# Altium project SCH-45852_C.PrjPcb (part 1 of 3)
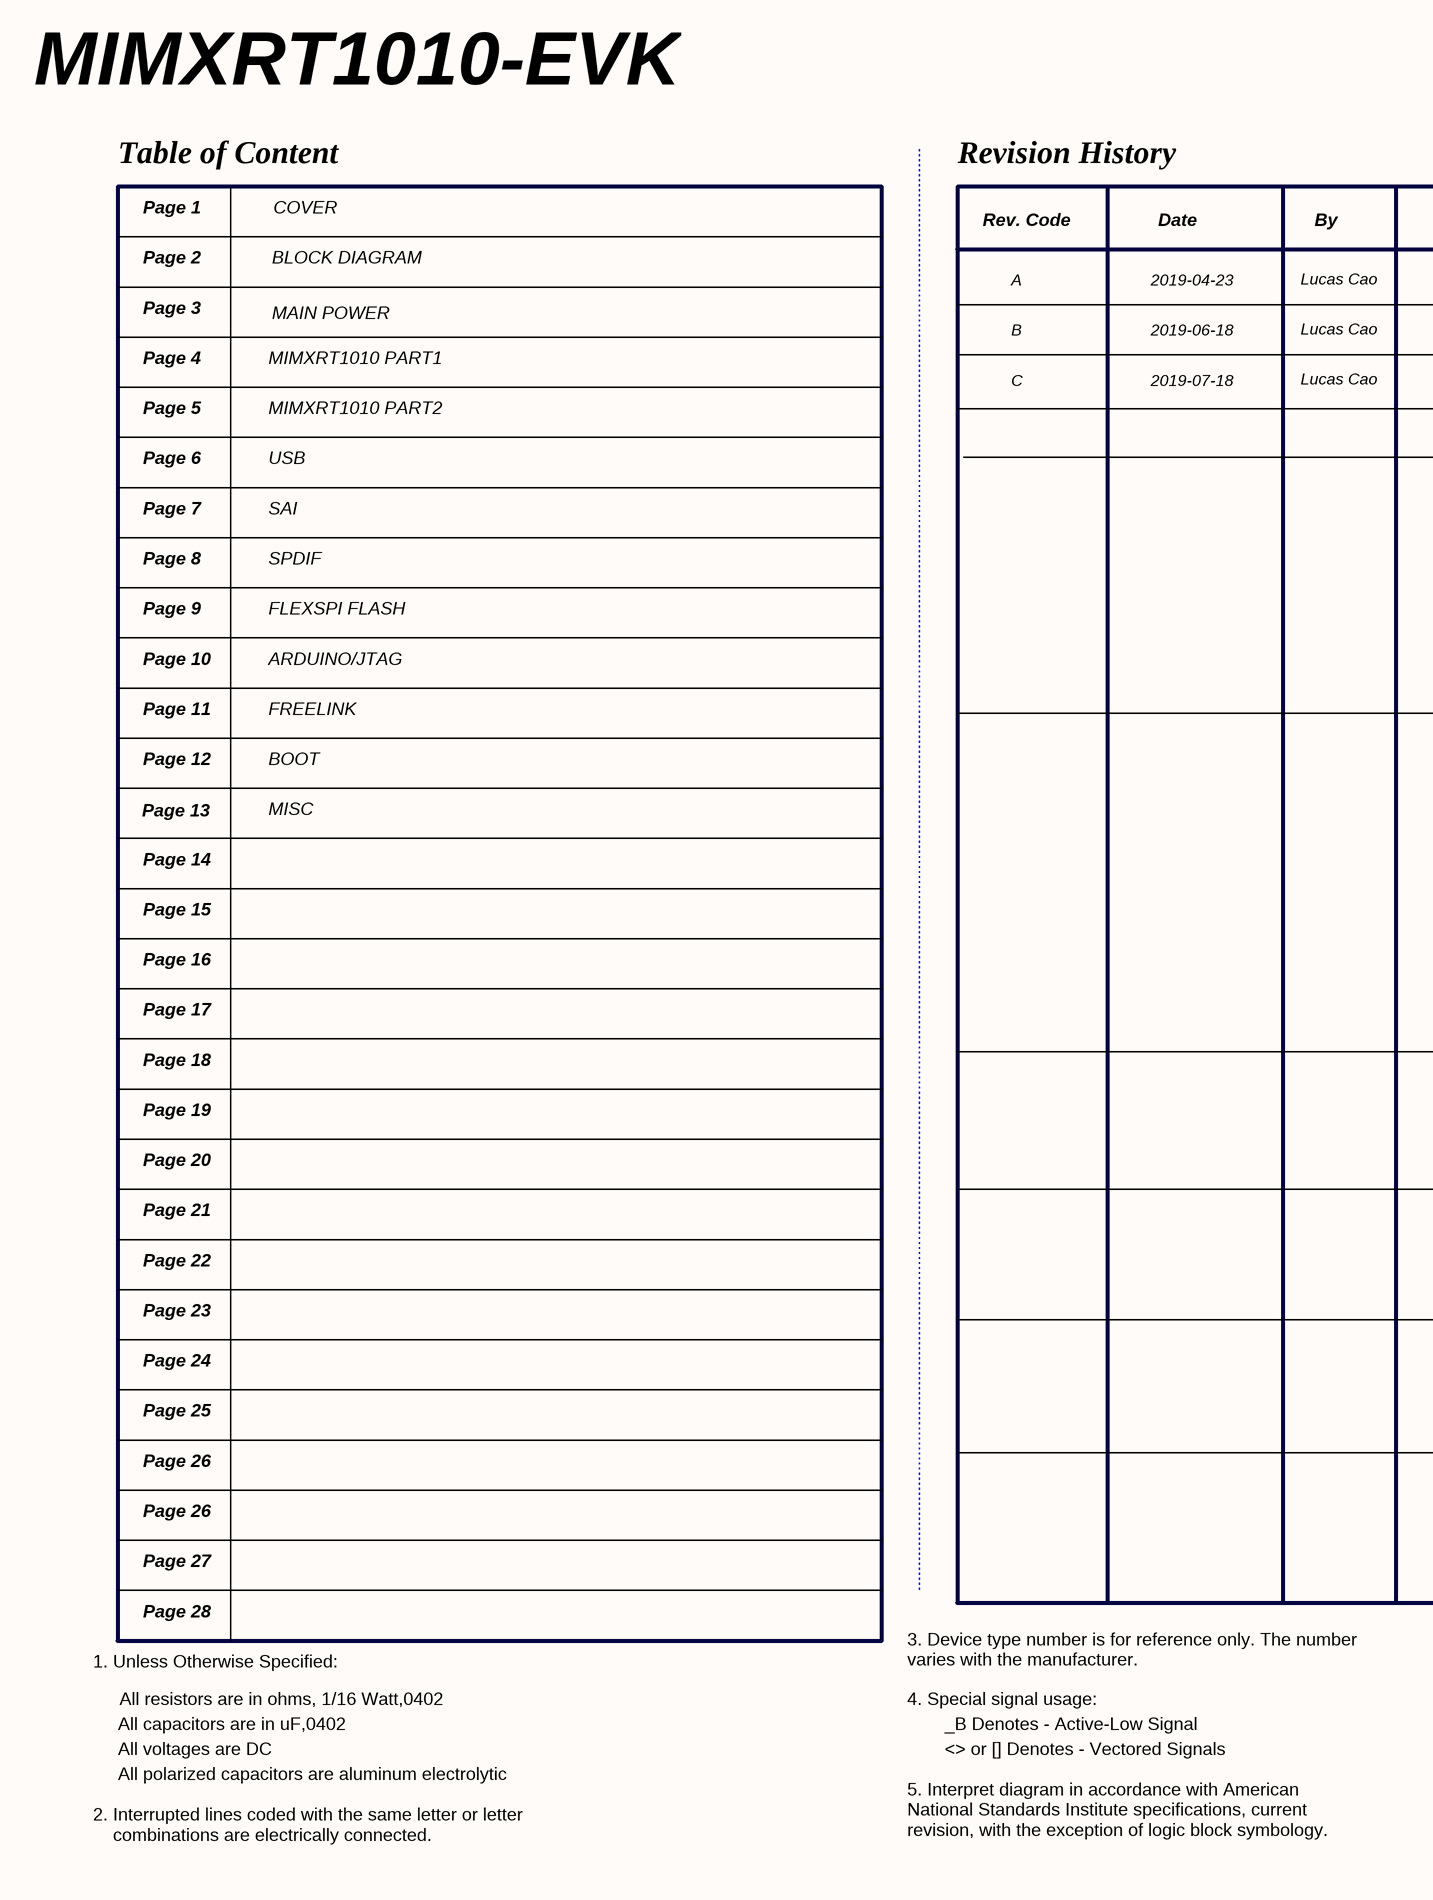
[diagram p0: 01 COVER.SchDoc, left]
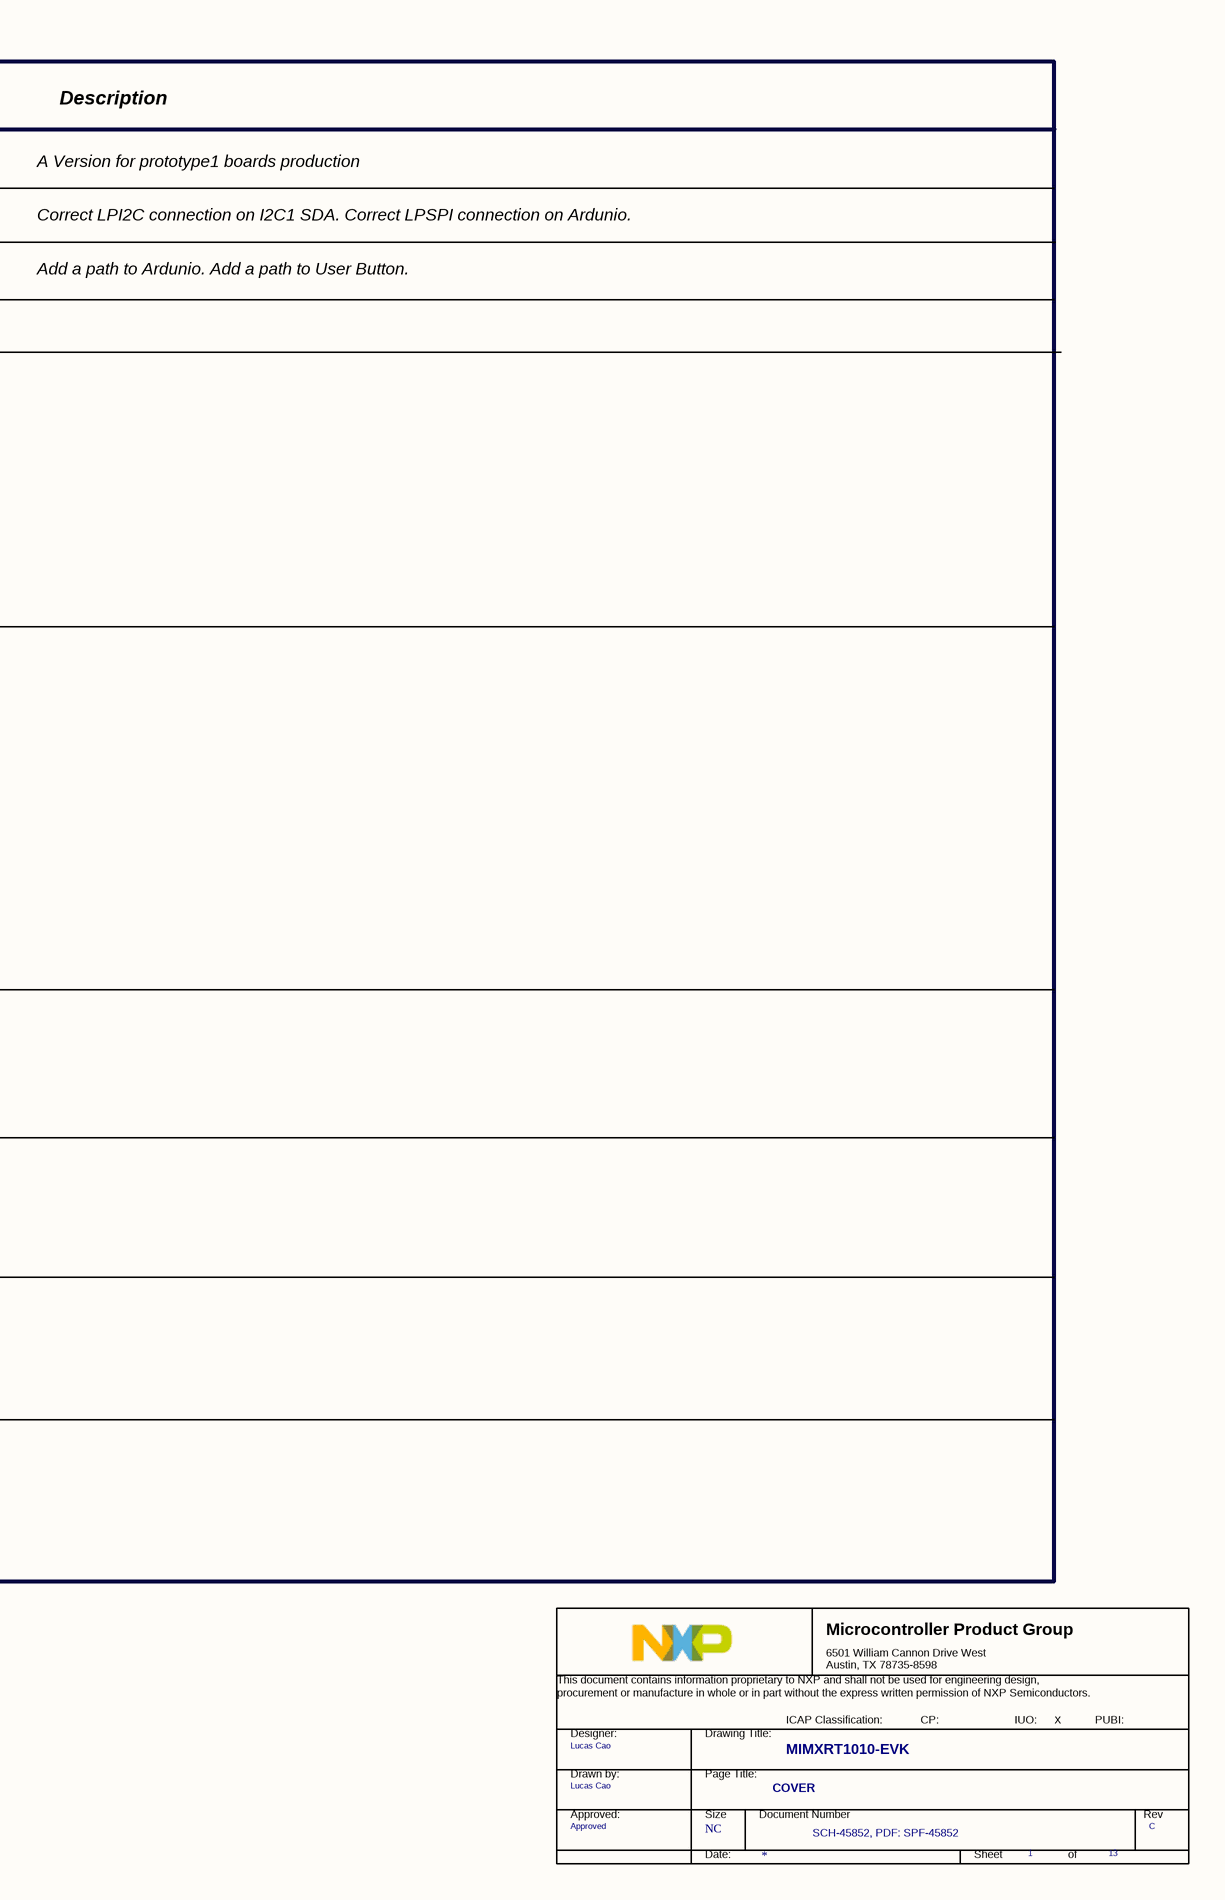
[diagram p1: 01 COVER.SchDoc, right]
13 sheets, 514 parts. Net scope: global (net labels, ports and power ports of the same name join across sheets).
Sheets:
  01 COVER.SchDoc
  02 BLOCK DIAGRAM.SchDoc
  03 MAIN POWER.SchDoc
  04 MIMXRT1010 PART1.SchDoc
  05 MIMXRT1010 PART2.SchDoc
  06 USB.SchDoc
  07 SAI.SchDoc
  08 SPDIF.SchDoc
  09 FLEXSPI FLASH.SchDoc
  10 ARDUINO_JTAG.SchDoc
  11 FREELINK.SchDoc
  12 BOOT.SchDoc
  13 MISC.SchDoc

## Sheet 01 COVER.SchDoc
size 513 x 386 mm

### Parts
(Parts that share a designator on the sheet are numbered #1, #2 ... from top to bottom, then left to right.)
*#1  Doc: SCH-45852, PDF: SPF-45852  RevCode: C  Title: MIMXRT1010-EVK  Page Size: NC  Page Number: 1  Page Count: 13  PageTitle: COVER  Designer: Lucas Cao  Approver: Approved  (hidden comment: TitleBlock_MCPG)  (graphical)

### Notes on the sheet
- MIMXRT1010-EVK
- Table of Content
- Revision History
- Page 1
- Page 2
- BLOCK DIAGRAM
- COVER
- Rev. Code
- Date
- By
- Description
- Page 3
- MAIN POWER
- A
- B
- 2019-04-23
- 2019-06-18
- Lucas Cao
- A Version for prototype1 boards production
- Correct LPI2C connection on I2C1 SDA. Correct LPSPI connection on Ardunio.
- Page 4
- MIMXRT1010 PART1
- C
- 2019-07-18
- Add a path to Ardunio. Add a path to User Button.
- Page 5
- MIMXRT1010 PART2
- Page 6
- Page 7
- USB
- SAI
- Page 8
- SPDIF
- Page 9
- FLEXSPI FLASH
- Page 10
- ARDUINO/JTAG
- Page 11
- Page 12
- FREELINK
- BOOT
- Page 13
- MISC
- Page 14
- Page 15
- Page 16
- Page 17
- Page 18
- Page 19
- Page 20
- Page 21
- Page 22
- Page 23
- Page 24
- Page 25
- Page 26
- Page 27
- Page 28
- 3. Device type number is for reference only. The number
  varies with the manufacturer.
- 1. Unless Otherwise Specified:
- All resistors are in ohms, 1/16 Watt,0402
- 4. Special signal usage:
- All capacitors are in uF,0402
- All voltages are DC
- 5. Interpret diagram in accordance with American
  National Standards Institute specifications, current
  revision, with the exception of logic block symbology.
- _B Denotes - Active-Low Signal
- <> or [] Denotes - Vectored Signals
- X
- 2. Interrupted lines coded with the same letter or letter
  combinations are electrically connected.
- All polarized capacitors are aluminum electrolytic
- (in symbol TitleBlock_MCPG) Microcontroller Product Group; 6501 William Cannon Drive West / Austin, TX 78735-8598; This document contains information proprietary to NXP and shall not be used for engineering design,; procurement or manufacture in whole or in part without the express written permission of NXP Semiconductors.; ICAP Classification:; CP:; IUO:; PUBI:; Designer:; Drawing Title:; Drawn by:; Page Title:; Approved:; Size; Document Number; Rev; Date:; Sheet; of

### Library data of the parts
*#1 = TitleBlock_MCPG: PUBI: ___; FIUO: X; OrgName: NXP Semiconductors; OrgAddr1: 6501 William Cannon Drive West; OrgAddr2: Austin, TX 78735-8598; Page Create Date: March  8, 1995; DrawnBy: Lucas Cao; Page Modify Date: *

## Sheet 02 BLOCK DIAGRAM.SchDoc
size 513 x 386 mm
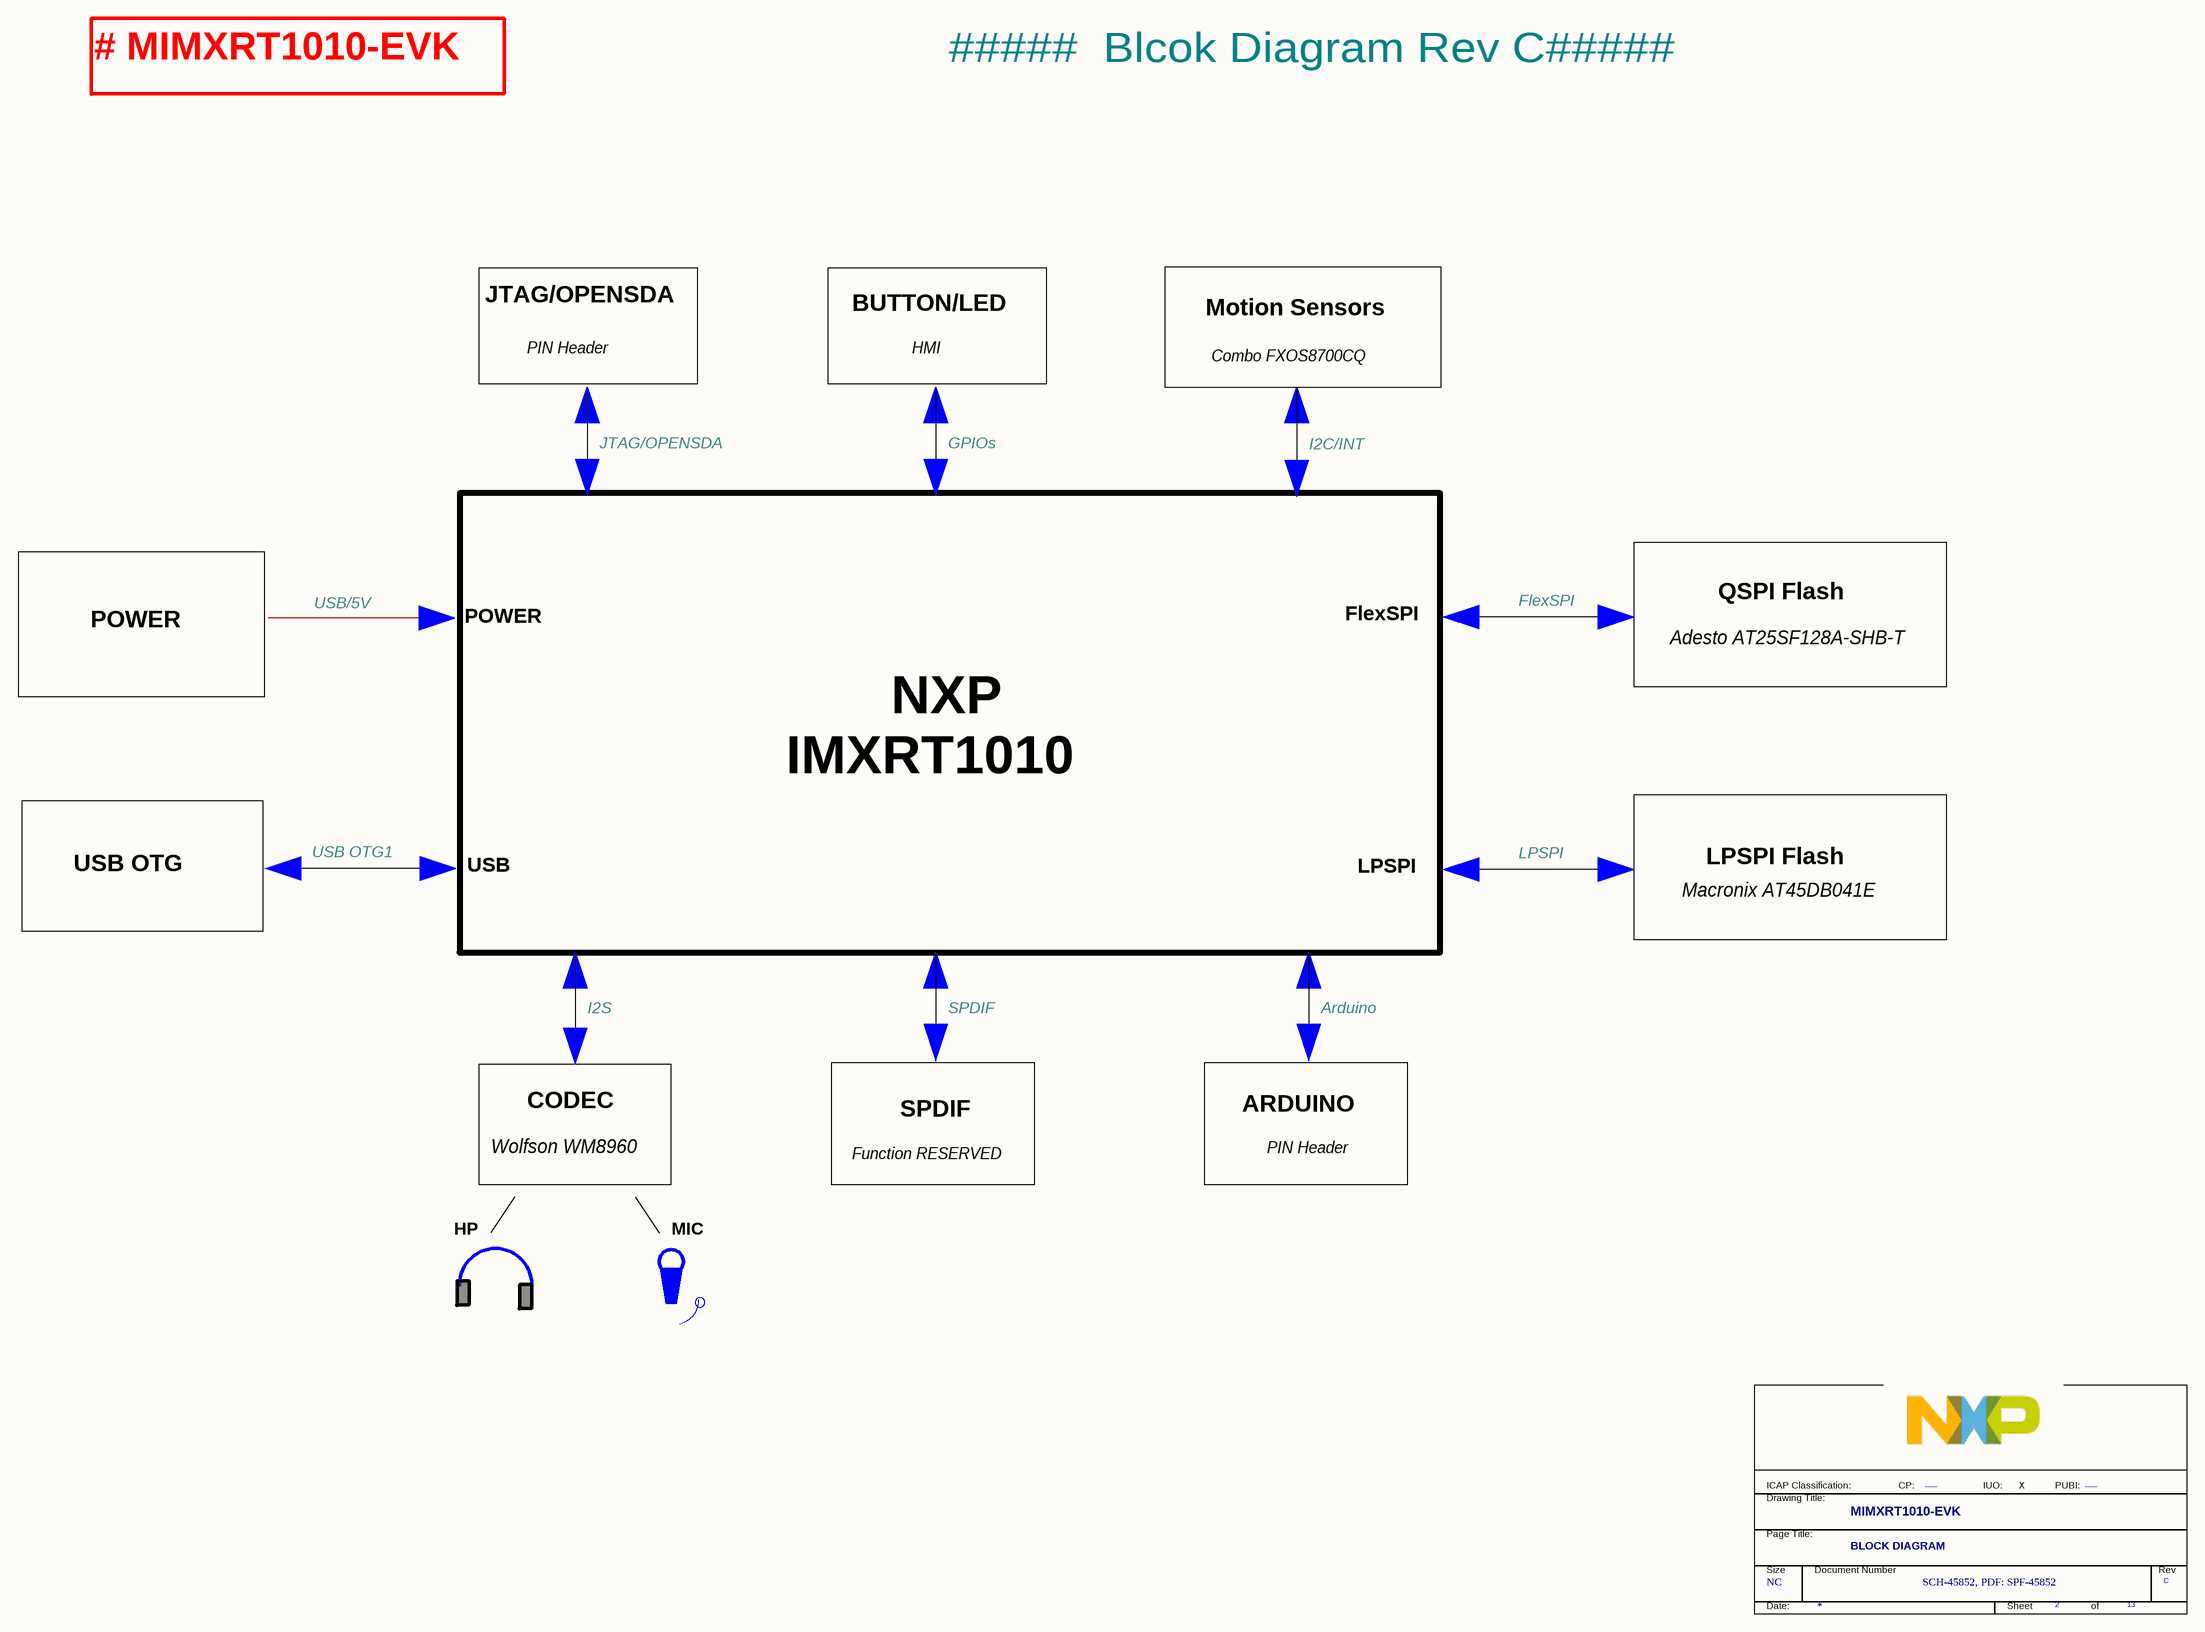
[diagram p2: 02 BLOCK DIAGRAM.SchDoc]

### Parts
(Parts that share a designator on the sheet are numbered #1, #2 ... from top to bottom, then left to right.)
*#2  PUBI: ___  Doc: SCH-45852, PDF: SPF-45852  RevCode: C  Title: MIMXRT1010-EVK  Page Size: NC  Page Number: 2  Page Count: 13  PageTitle: BLOCK DIAGRAM  (hidden comment: TitleBlock_FS)  (graphical)

### Notes on the sheet
- # MIMXRT1010-EVK
- #####  Blcok Diagram Rev C#####
- JTAG/OPENSDA
- BUTTON/LED
- Motion Sensors
- PIN Header
- HMI
- Combo FXOS8700CQ
- GPIOs
- I2C/INT
- USB/5V
- POWER
- FlexSPI
- QSPI Flash
- NXP
  IMXRT1010
- Adesto AT25SF128A-SHB-T
- USB OTG1
- LPSPI
- LPSPI Flash
- USB OTG
- USB
- Macronix AT45DB041E
- I2S
- SPDIF
- Arduino
- Wolfson WM8960
- CODEC
- Function RESERVED
- ARDUINO
- HP
- MIC
- X
- (in symbol TitleBlock_FS) ICAP Classification:; CP:; IUO:; PUBI:; Drawing Title:; Page Title:; Size; Document Number; Rev; Date:; Sheet; of

### Library data of the parts
*#2 = TitleBlock_FS: FIUO: _X_; OrgAddr2: Austin, TX 78735-8598; OrgAddr1: 6501 William Cannon Drive West; OrgName: Freescale Semiconductor; FCP: ___; Page Create Date: March  8, 1995; Page Modify Date: *

## Sheet 03 MAIN POWER.SchDoc
size 513 x 386 mm
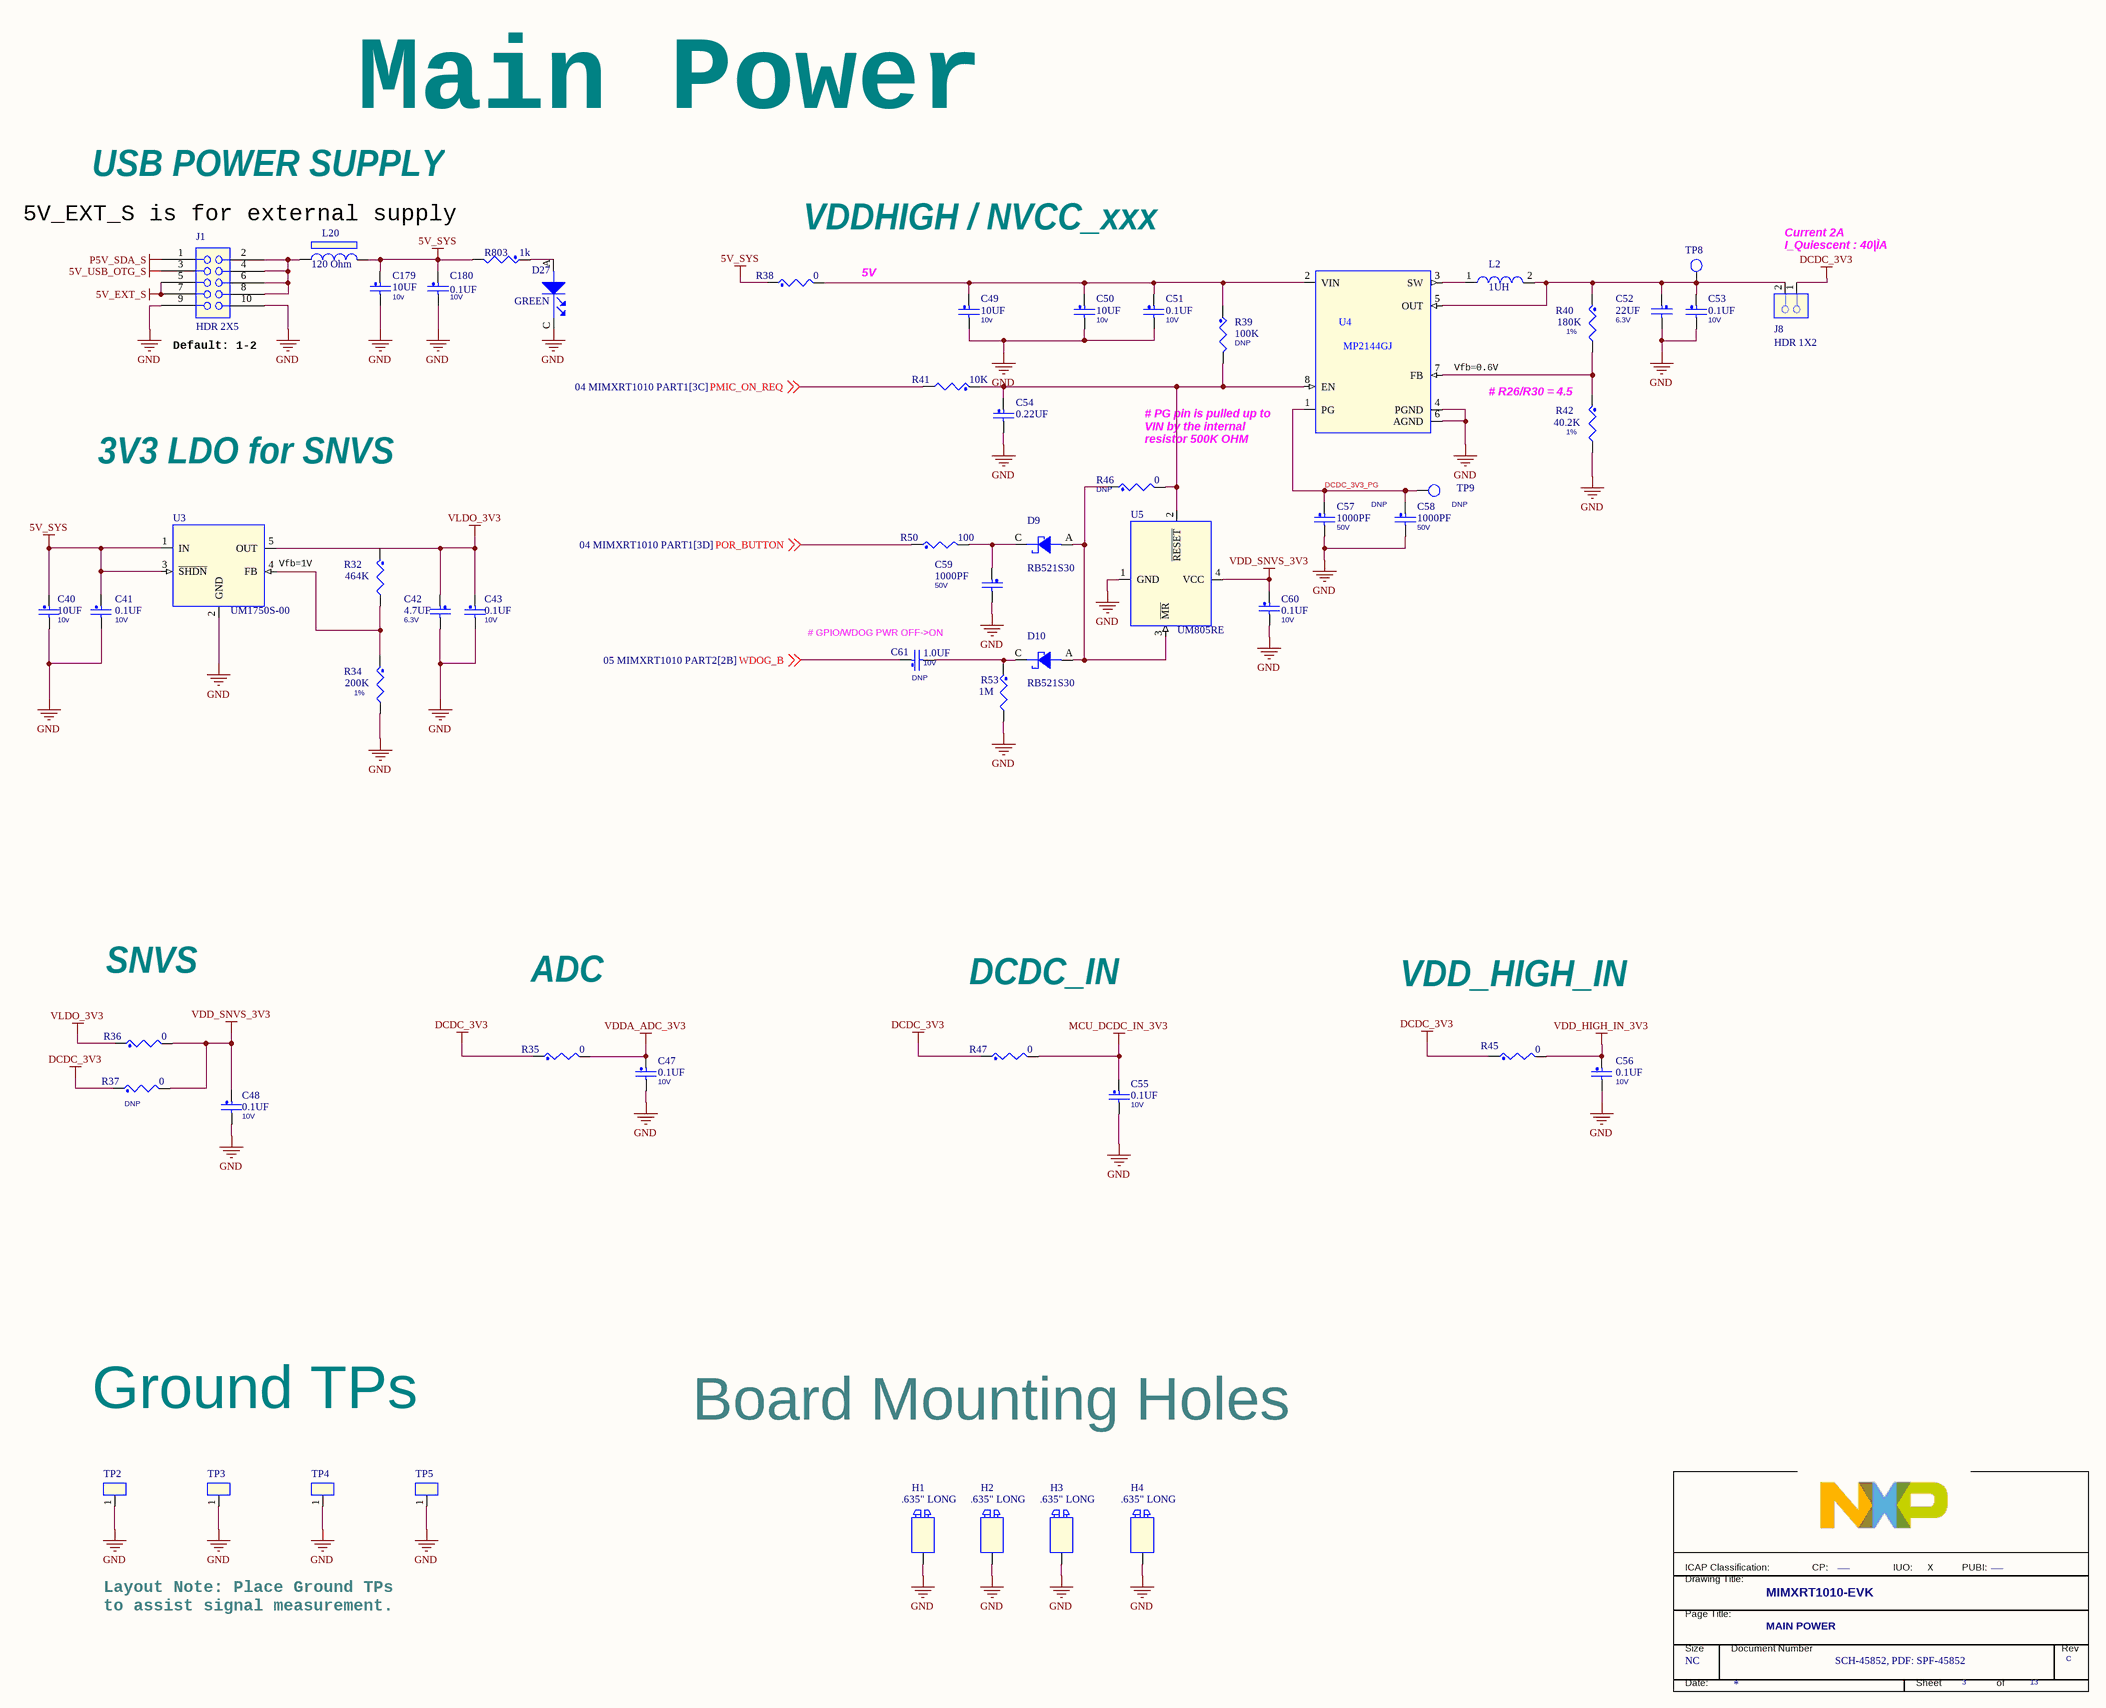
[diagram p3: 03 MAIN POWER.SchDoc]

### Parts
(Parts that share a designator on the sheet are numbered #1, #2 ... from top to bottom, then left to right.)
*#3  PUBI: ___  Doc: SCH-45852, PDF: SPF-45852  RevCode: C  Title: MIMXRT1010-EVK  Page Size: NC  Page Number: 3  Page Count: 13  PageTitle: MAIN POWER  (hidden comment: TitleBlock_FS)  (graphical)
C40  10UF  VOLTAGE: 10v  [CC0603_OV]
C41  0.1UF  VOLTAGE: 10V  [CC0402_25]
C42  4.7UF  voltage rating: 6.3V  [0402_CC]
C43  0.1UF  VOLTAGE: 10V  [CC0402_25]
C47  0.1UF  VOLTAGE: 10V  [CC0402_25]
C48  0.1UF  VOLTAGE: 10V  [CC0402_25]
C49  10UF  VOLTAGE: 10v  [CC0603_OV]
C50  10UF  VOLTAGE: 10v  [CC0603_OV]
C51  0.1UF  VOLTAGE: 10V  [CC0402_25]
C52  22UF  voltage rating: 6.3V  [0603_CC]
C53  0.1UF  VOLTAGE: 10V  [CC0402_25]
C54  0.22UF  [0402_CC]
C55  0.1UF  VOLTAGE: 10V  [CC0402_25]
C56  0.1UF  VOLTAGE: 10V  [CC0402_25]
C57  1000PF  ASSY_OPT: DNP  VOLTAGE: 50V  [0402_CC]
C58  1000PF  ASSY_OPT: DNP  VOLTAGE: 50V  [0402_CC]
C59  1000PF  VOLTAGE: 50V  [0402_CC]
C60  0.1UF  VOLTAGE: 10V  [CC0402_25]
C61  1.0UF  ASSY_OPT: DNP  VOLTAGE: 10V  [0402_cc]
C179  10UF  VOLTAGE: 10v  [CC0603_OV]
C180  0.1UF  VOLTAGE: 10V  [CC0402_25]
D9  RB521S30  [SOD523]
D10  RB521S30  [SOD523]
D27  GREEN  [LED_0603]
H1  .635" LONG  [spacer_139t]
H2  .635" LONG  [spacer_139t]
H3  .635" LONG  [spacer_139t]
H4  .635" LONG  [spacer_139t]
J1  HDR 2X5  [hdr205]
J8  HDR 1X2  [HDR102]
L2  1UH  [ind_4020]
L20  120 Ohm  [0402_CC]
R32  464K  [0402_CC]
R34  200K  Tolerance: 1%  [0402_CC]
R35  0  [0402_CC]
R36  0  [0402_CC]
R37  0  ASSY_OPT: DNP  [0402_CC]
R38  0  [0402_CC]
R39  100K  ASSY_OPT: DNP  [0402_CC]
R40  180K  Tolerance: 1%  [0402_CC]
R41  10K  [0402_CC]
R42  40.2K  Tolerance: 1%  [0402_CC]
R45  0  [0402_CC]
R46  0  ASSY_OPT: DNP  [0402_CC]
R47  0  [0402_CC]
R50  100  [0402_CC]
R53  1M  [0402_CC]
R803  1k  [0402_CC]
TP2  5006  [tp_th_063]  (value not drawn)
TP3  5006  [tp_th_063]  (value not drawn)
TP4  5006  [tp_th_063]  (value not drawn)
TP5  5006  [tp_th_063]  (value not drawn)
TP8  TP_35MIL  [testpoint_35mil]  (value not drawn)
TP9  TP_35MIL  [testpoint_35mil]  (value not drawn)
U3  UM1750S-00  [sot23-5_a]
U4  MP2144GJ  [tsot23_8_0p65_2x1]
U5  UM805RE  [sot_143]

### Nets
5V_EXT_S: J1.5(A3) J1.7(A4)
5V_SYS: C40.1 C41.1 C179.1 C180.1 L20.2 R38.1 R803.2 U3.1(IN) U3.3(~{SHDN})
5V_USB_OTG_S: J1.3(A2)
DCDC_3V3: J8.1 R35.1 R37.1 R45.1 R47.1
GND: C40.2 C41.2 C42.2 C43.2 C47.2 C48.2 C49.2 C50.2 C51.2 C52.2 C53.2 C54.2 C55.2 C56.2 C57.2 C58.2 C59.2 C60.2 C179.2 C180.2 D27.C(CATHODE) H1.1(NC_1) H2.1(NC_1) H3.1(NC_1) H4.1(NC_1) J1.9(A5) J1.10(B5) R34.2 R42.2 R53.2 TP2.1 TP3.1 TP4.1 TP5.1 U3.2(GND) U4.4(PGND) U4.6(AGND) U5.1(GND)
MCU_DCDC_IN_3V3: C55.1 R47.2
P5V_SDA_S: J1.1(A1)
VDD_HIGH_IN_3V3: C56.1 R45.2
VDD_SNVS_3V3: C48.1 C60.1 R36.2 R37.2 U5.4(VCC)
VDDA_ADC_3V3: C47.1 R35.2
VLDO_3V3: C42.1 C43.1 R32.1 R36.1 U3.5(OUT)
DCDC_3V3_PG: C57.1 C58.1 TP9.1(TP) U4.1(PG)
PMIC_ON_REQ: R41.2 ; off-sheet PMIC_ON_REQ
POR_BUTTON: R50.1 ; off-sheet POR_BUTTON
WDOG_B: C61.1 ; off-sheet WDOG_B  [project net JTAG_MOD]
NetC49_1: C49.1 C50.1 C51.1 R38.2 R39.1 U4.2(VIN)
NetC52_1: C52.1 C53.1 J8.2 L2.2 R40.1 TP8.1(TP) U4.5(OUT)
NetC54_1: C54.1 R39.2 R41.1 R46.2 U4.8(EN) U5.2(~{RESET})
NetC59_1: C59.1 D9.C R50.2
NetC61_2: C61.2 D10.C R53.1
NetD9_A: D9.A D10.A R46.1 U5.3(~{MR})
NetD27_A: D27.A(ANODE) R803.1
NetJ1_2: J1.2(B1) J1.4(B2) J1.6(B3) J1.8(B4) L20.1
NetL2_1: L2.1 U4.3(SW)
NetR32_2: R32.2 R34.1 U3.4(FB)
NetR40_2: R40.2 R42.1 U4.7(FB)

### Notes on the sheet
- Main Power
- 5V_EXT_S is for external supply
- USB POWER SUPPLY
- VDDHIGH / NVCC_xxx
- 5V
- (near J8) Current 2A
  I_Quiescent : 40|ÌA
- (near J1) Default: 1-2
- (near U4) Vfb=0.6V
- (near R42) # R26/R30 = 4.5
- (near U4) # PG pin is pulled up to
  VIN by the internal
  resistor 500K OHM
- 3V3 LDO for SNVS
- (near U3) Vfb=1V
- (near C61) # GPIO/WDOG PWR OFF->ON
- SNVS
- ADC
- DCDC_IN
- VDD_HIGH_IN
- Ground TPs
- Board Mounting Holes
- Layout Note: Place Ground TPs
  to assist signal measurement.
- X
- (in symbol TitleBlock_FS) ICAP Classification:; CP:; IUO:; PUBI:; Drawing Title:; Page Title:; Size; Document Number; Rev; Date:; Sheet; of

### Library data of the parts
*#3 = TitleBlock_FS: as *#2 on sheet 02 BLOCK DIAGRAM; FCP: ___; Page Create Date: March  8, 1995; Page Modify Date: *
C40 C49 = CAP_NP: CAP CER 10UF 10V 10% X5R 0603; CLASS: DISCRETE; FPLIST: CC0603_OV,CC0603,0603_CC; CAD_APPROVED: Yes; Temp_Range: -55¡ãC ~ 85¡ãC; MFG_PN01: GRM188R61A106KE69D; MFG_NAME01: MURATA; AGILE_PN: 150-78675; PCB Footprint: CC0603_OV; HEIGHT: 1.016MM; ROHS: Yes; Tolerance: 10%
C41 C43 C47 C48 C55 C56 = CAP_NP: CAP CER 0.1UF 10V 10% X5R 0402; CLASS: DISCRETE; FPLIST: CC0402_25,CC0402_HD,0402_CC; CAD_APPROVED: Yes; MFG_PN01: CC0402KRX5R6BB104; MFG_NAME01: YAGEO AMERICA; AGILE_PN: 150-75634; PCB Footprint: CC0402_25; HEIGHT: 0.64MM; ROHS: Yes; Tolerance: 10%
C42 = CAP_NP: CAP CER 4.7UF 6.3V 20% X5R 0402; CLASS: DISCRETE; FPLIST: CC0402_25,CC0402_HD,0402_CC; CAD_APPROVED: Yes; MFG_PN01: C1005X5R0J475M050BC; MFG_NAME01: TDK; AGILE_PN: 150-78463; PCB Footprint: 0402_CC; HEIGHT: 0.65MM; ROHS: Yes; Tolerance: 20%; VOLTAGE: 6.3V
C50 C179 = CAP_NP: CAP CER 10UF 10V 10% X5R 0603; CLASS: DISCRETE; AGILE_PN: 150-78675; MFG_NAME01: MURATA; MFG_PN01: GRM188R61A106KE69D; Temp_Range: -55¡ãC ~ 85¡ãC; CAD_APPROVED: Yes; FPLIST: CC0603_OV,CC0603,0603_CC; PCB Footprint: CC0603_OV; Tolerance: 10%; ROHS: Yes; HEIGHT: 1.016MM
C51 C53 C60 C180 = CAP_NP: CAP CER 0.1UF 10V 10% X5R 0402; CLASS: DISCRETE; AGILE_PN: 150-75634; MFG_NAME01: YAGEO AMERICA; MFG_PN01: CC0402KRX5R6BB104; CAD_APPROVED: Yes; FPLIST: CC0402_25,CC0402_HD,0402_CC; PCB Footprint: CC0402_25; Tolerance: 10%; ROHS: Yes; HEIGHT: 0.64MM
C52 = CAP_NP: CAP CER 22UF 6.3V 20% X5R 0603; CLASS: DISCRETE; AGILE_PN: 150-78467; MFG_NAME01: Samsung; MFG_PN01: CL10A226MQ8NRNE; CAD_APPROVED: Yes; FPLIST: CC0603_OV,CC0603,0603_CC; PCB Footprint: 0603_CC; Tolerance: 20%; ROHS: Yes; HEIGHT: 1MM; VOLTAGE: 6.3V
C54 = CAP_NP: CAP CER 0.22UF 6.3V 20% X5R 0402; CLASS: DISCRETE; AGILE_PN: 150-76271; MFG_NAME01: KEMET; MFG_PN01: C0402C224M9PAC; CAD_APPROVED: Yes; FPLIST: CC0402_25,CC0402_HD,0402_CC; PCB Footprint: 0402_CC; Tolerance: 20%; ROHS: Yes; HEIGHT: 0.55MM; VOLTAGE: 6.3V
C57 = CAP_NP: CAP CER 1000PF 50V 5% C0G 0402; CLASS: DISCRETE; FPLIST: CC0402_25,CC0402_HD,0402_CC; CAD_APPROVED: Yes; MFG_PN01: GRM1555C1H102JA01D; MFG_NAME01: MURATA; AGILE_PN: 150-76334; PCB Footprint: 0402_CC; HEIGHT: 0.55MM; ROHS: Yes; Tolerance: 5%
C58 C59 = CAP_NP: CAP CER 1000PF 50V 5% C0G 0402; CLASS: DISCRETE; AGILE_PN: 150-76334; MFG_NAME01: MURATA; MFG_PN01: GRM1555C1H102JA01D; CAD_APPROVED: Yes; FPLIST: CC0402_25,CC0402_HD,0402_CC; PCB Footprint: 0402_CC; Tolerance: 5%; ROHS: Yes; HEIGHT: 0.55MM
C61 = CAP_NP: CAP CER 1.0UF 10V 10% X5R 0402; CLASS: DISCRETE; FPLIST: CC0402_25,CC0402_HD,0402_CC; CAD_APPROVED: Yes; MFG_PN01: CC0402KRX5R6BB105; MFG_NAME01: YAGEO AMERICA; AGILE_PN: 150-75772; PCB Footprint: 0402_cc; HEIGHT: 0.6MM; ROHS: Yes
D9 = DIODE_SCHTKY: DIODE SCH RECT 200MA 30V AEC-Q101 SOD-523; CLASS: IC; AGILE_PN: 480-79672; MFG_NAME01: NEXPERIA; MFG_PN01: RB521S30,115; CAD_APPROVED: Yes; PCB Footprint: SOD523; ROHS: Yes; HEIGHT: 0.65MM
D10 = DIODE_SCHTKY: DIODE SCH RECT 200MA 30V AEC-Q101 SOD-523; CLASS: IC; CAD_APPROVED: Yes; MFG_PN01: RB521S30,115; MFG_NAME01: NEXPERIA; AGILE_PN: 480-79672; PCB Footprint: SOD523; HEIGHT: 0.65MM; ROHS: Yes
D27 = LED: LED GRN SGL 25MA 0603; CLASS: IC; AGILE_PN: 370-76549; MFG_NAME01: KINGBRIGHT; MFG_PN01: KPT-1608SGC; CAD_APPROVED: Yes; PCB Footprint: LED_0603; ROHS: Yes; HEIGHT: 0.85MM
H1-H4 = SPACER: FASTENER, STANDOFF 4.5MMX3.53XM3.0X0.5 ROUND THR .635"L BRASS; CLASS: IC; CAD_APPROVED: Yes; ASSY_OPT: DNP; MFG_PN01: MSS251-R-1-A-16; MFG_NAME01: UNICORP; AGILE_PN: 280-76498; PCB Footprint: spacer_139t; HEIGHT: 16.13MM; ROHS: Yes
J1 = CONN_HDR_5X2: HDR 2X5 TH 100MIL CTR 338H AU 98L; CLASS: IO; CAD_APPROVED: Yes; Temp_Range: -55DegC to +105DegC; MFG_PN01: 0902S1005011N9T-31RF; MFG_NAME01: ANYTRONIC CORPORATION LIMITED; AGILE_PN: 210-81467; PCB Footprint: hdr205; HEIGHT: 8.59MM; ROHS: Yes
J8 = CONN_HDR_2X1: HDR 1X2 TH 100MIL SP 339H AU 98L; CLASS: IO; AGILE_PN: 210-81490; MFG_NAME01: ANYTRONIC CORPORATION LIMITED; MFG_PN01: 0901S0202011N9T-31RF; Temp_Range: -55¡ãC to +105¡ãC; CAD_APPROVED: Yes; PCB Footprint: HDR102; ROHS: Yes; HEIGHT: 8.59MM
L2 = IND: IND PWR 1UH@100KHZ 2.6A 30% SMT; PART_TYPE: INDUCTOR\POWER; CLASS: DISCRETE; AGILE_PN: 180-77797; MFG_NAME01: Shenzhen Sunlord Electronics Co., Ltd; MFG_PN01: SWPA4020S1R0NT; CAD_APPROVED: Yes; PCB Footprint: ind_4020; Tolerance: 30%; TOL: 30%; ROHS: Yes; HEIGHT: 2.2MM
L20 = INDUCTOR_FERRITE: IND FER BEAD 120 OHM@100MHZ 0.5A 25% 0402; PART_TYPE: FERRITE\BEAD; CLASS: DISCRETE; FPLIST: IND_0402,0402_CC; CAD_APPROVED: Yes; MFG_PN01: BLM15AG121SN1D; MFG_NAME01: Murata; AGILE_PN: 180-77771; PCB Footprint: 0402_CC; HEIGHT: 0.55MM; ROHS: Yes; Tolerance: 25%
R32 = RES_Dup1: RES MF 464K 1/10W 1% AEC-Q200 0402; CLASS: DISCRETE; Temp_Range: -55C to +155C; AGILE_PN: 470-31135; MFG_NAME01: KOA SPEER; MFG_PN01: RK73H1ETTP4643F; CAD_APPROVED: Yes; FPLIST: RC0402_25,RC0402_HD,0402_CC; PCB Footprint: 0402_CC; Tolerance: 1%; ROHS: Yes; HEIGHT: 0.40 MM
R34 = RES_Dup1: RES MF 200K 1/10W 1% AEC-Q200 0402; CLASS: DISCRETE; AGILE_PN: 470-31093; MFG_NAME01: KOA SPEER; MFG_PN01: RK73H1ETTP2003F; CAD_APPROVED: Yes; FPLIST: RC0402_25,RC0402_HD,0402_CC; Temp_Range: -55C to +155C; PCB Footprint: 0402_CC; HEIGHT: 0.40 MM; ROHS: Yes
R35 R36 R38 R47 = RES_Dup1: RES MF ZERO OHM 1/16W 5% 0402; CLASS: DISCRETE; FPLIST: RC0402_25,RC0402_HD,RC0402_X2,0402_CC; CAD_APPROVED: Yes; MFG_PN01: MCR01MZPJ000; MFG_NAME01: ROHM; AGILE_PN: 470-75394; PCB Footprint: 0402_CC; ROHS: Yes; Tolerance: 5%; HEIGHT: 0.45 MM
R37 R45 R46 = RES_Dup1: RES MF ZERO OHM 1/16W 5% 0402; CLASS: DISCRETE; AGILE_PN: 470-75394; MFG_NAME01: ROHM; MFG_PN01: MCR01MZPJ000; CAD_APPROVED: Yes; FPLIST: RC0402_25,RC0402_HD,RC0402_X2,0402_CC; PCB Footprint: 0402_CC; HEIGHT: 0.45 MM; Tolerance: 5%; ROHS: Yes
R39 = RES_Dup1: RES MF 100K 1/16W 5% 0402; CLASS: DISCRETE; FPLIST: RC0402_25,RC0402_HD,0402_CC; CAD_APPROVED: Yes; MFG_PN01: CR0402-16W-104JT; MFG_NAME01: VENKEL COMPANY; AGILE_PN: 470-75597; Temp_Range: -55C to +155C; PCB Footprint: 0402_CC; HEIGHT: 0.40 MM; ROHS: Yes; Tolerance: 5%
R40 = RES_Dup1: RES MF 180K 1/10W 1% AEC-Q200 0402; CLASS: DISCRETE; Temp_Range: -55C to +155C; FPLIST: RC0402_25,RC0402_HD,0402_CC; CAD_APPROVED: Yes; MFG_PN01: RK73H1ETTP1803F; MFG_NAME01: KOA SPEER; AGILE_PN: 470-31088; PCB Footprint: 0402_CC; HEIGHT: 0.40 MM; ROHS: Yes
R41 = RES_Dup1: RES MF 10K 1/16W 5% 0402; CLASS: DISCRETE; AGILE_PN: 470-75557; MFG_NAME01: VISHAY INTERTECHNOLOGY; MFG_PN01: CRCW040210K0JNED; CAD_APPROVED: Yes; FPLIST: RC0402_25,RC0402_HD,0402_CC; PCB Footprint: 0402_CC; Tolerance: 5%; ROHS: Yes; HEIGHT: 0.4 MM
R42 = RES_Dup1: RES MF 40.2K  1/16W 1% 0402; CLASS: DISCRETE; Temp_Range: -55C to +155C; FPLIST: RC0402_25,RC0402_HD,0402_CC; CAD_APPROVED: Yes; MFG_PN01: RC0402FR-0740K2L; MFG_NAME01: YAGEO AMERICA; AGILE_PN: 470-31015; PCB Footprint: 0402_CC; ROHS: Yes; HEIGHT: 0.40 MM
R50 = RES_Dup1: RES MF 100 OHM 1/16W 1% 0402; CLASS: DISCRETE; FPLIST: RC0402_25,RC0402_HD,0402_CC; CAD_APPROVED: Yes; MFG_PN01: CR-02FL6--100R; MFG_NAME01: THYE MING TECH CO LTD; AGILE_PN: 470-30454; PCB Footprint: 0402_CC; ROHS: Yes; Tolerance: 1%; HEIGHT: 0.4 MM
R53 = RES_Dup1: RES MF 1M 1/10W 5% AEC-Q200 0402; CLASS: DISCRETE; FPLIST: RC0402_25,RC0402_HD,0402_CC; CAD_APPROVED: Yes; MFG_PN01: RK73B1ETTP105J; MFG_NAME01: KOA SPEER; AGILE_PN: 470-79978; Temp_Range: -55&#8451; to 155&#8451;; PCB Footprint: 0402_CC; ROHS: Yes; Tolerance: 5%; HEIGHT: 0.4MM
R803 = RES_Dup1: RES MF 1.0K 1/16W 5% 0402; CLASS: DISCRETE; AGILE_PN: 470-75555; MFG_NAME01: VISHAY INTERTECHNOLOGY; MFG_PN01: CRCW04021K00JNED; CAD_APPROVED: Yes; FPLIST: RC0402_25,RC0402_HD,RC0402_X2,0402_CC; PCB Footprint: 0402_CC; Tolerance: 5%; ROHS: Yes; HEIGHT: 0.41mm
TP2 TP4 = TEST_POINT: TEST POINT BLK 70X220 MIL TH; CLASS: IC; CAD_APPROVED: Yes; MFG_NAME01: Keystone Electronics; AGILE_PN: 210-30155; PCB Footprint: tp_th_063; HEIGHT: 5.6MM; ROHS: Yes; MFG_PN01: 5006
TP3 TP5 = TEST_POINT: TEST POINT BLK 70X220 MIL TH; CLASS: IC; AGILE_PN: 210-30155; MFG_NAME01: Keystone Electronics; CAD_APPROVED: Yes; PCB Footprint: tp_th_063; MFG_PN01: 5006; ROHS: Yes; HEIGHT: 5.6MM
TP8 TP9 = T POINT R: TEST POINT PAD .035 SMT, no part to order; CLASS: IC; AGILE_PN: 510-75618; CAD_APPROVED: Yes; PCB Footprint: testpoint_35mil; ROHS: Yes; HEIGHT: 0.1MM
U3 = UM1750S-00_5P: IC VREG LDO ADJ 1-5V 350mA 2.5-6V SOT23-5; AGILE_PN: 315-80554; MFG_NAME01: Union Semiconductor, Inc; CAD_APPROVED: Yes; CLASS: IC; PCB Footprint: sot23-5_a; MFG_PN01: UM1750S-00; ROHS: Yes; HEIGHT: 1.25MM
U4 = MP2144GJ_TSOT23_8P: IC SYNC STEP-DOWN SW 1.2MHZ 0.6V 2A 2.5-5.5V TSOT23-8; AGILE_PN: 315-80508; MFG_NAME01: MONOLITHIC POWER SYSTEMS; CAD_APPROVED: Yes; CLASS: IC; PCB Footprint: tsot23_8_0p65_2x1; MFG_PN01: MP2144GJ; ROHS: Yes; HEIGHT: 1MM
U5 = UM805_4P: IC VOLT MONITOR 2.63V VTH RST 1-5.5V SOT143; CAD_APPROVED: Yes; MFG_NAME01: Union Semiconductor, Inc; AGILE_PN: 315-80564; CLASS: IC; PCB Footprint: sot_143; HEIGHT: 1.22MM; ROHS: Yes; MFG_PN01: UM805RE

## Sheet 04 MIMXRT1010 PART1.SchDoc
size 513 x 386 mm
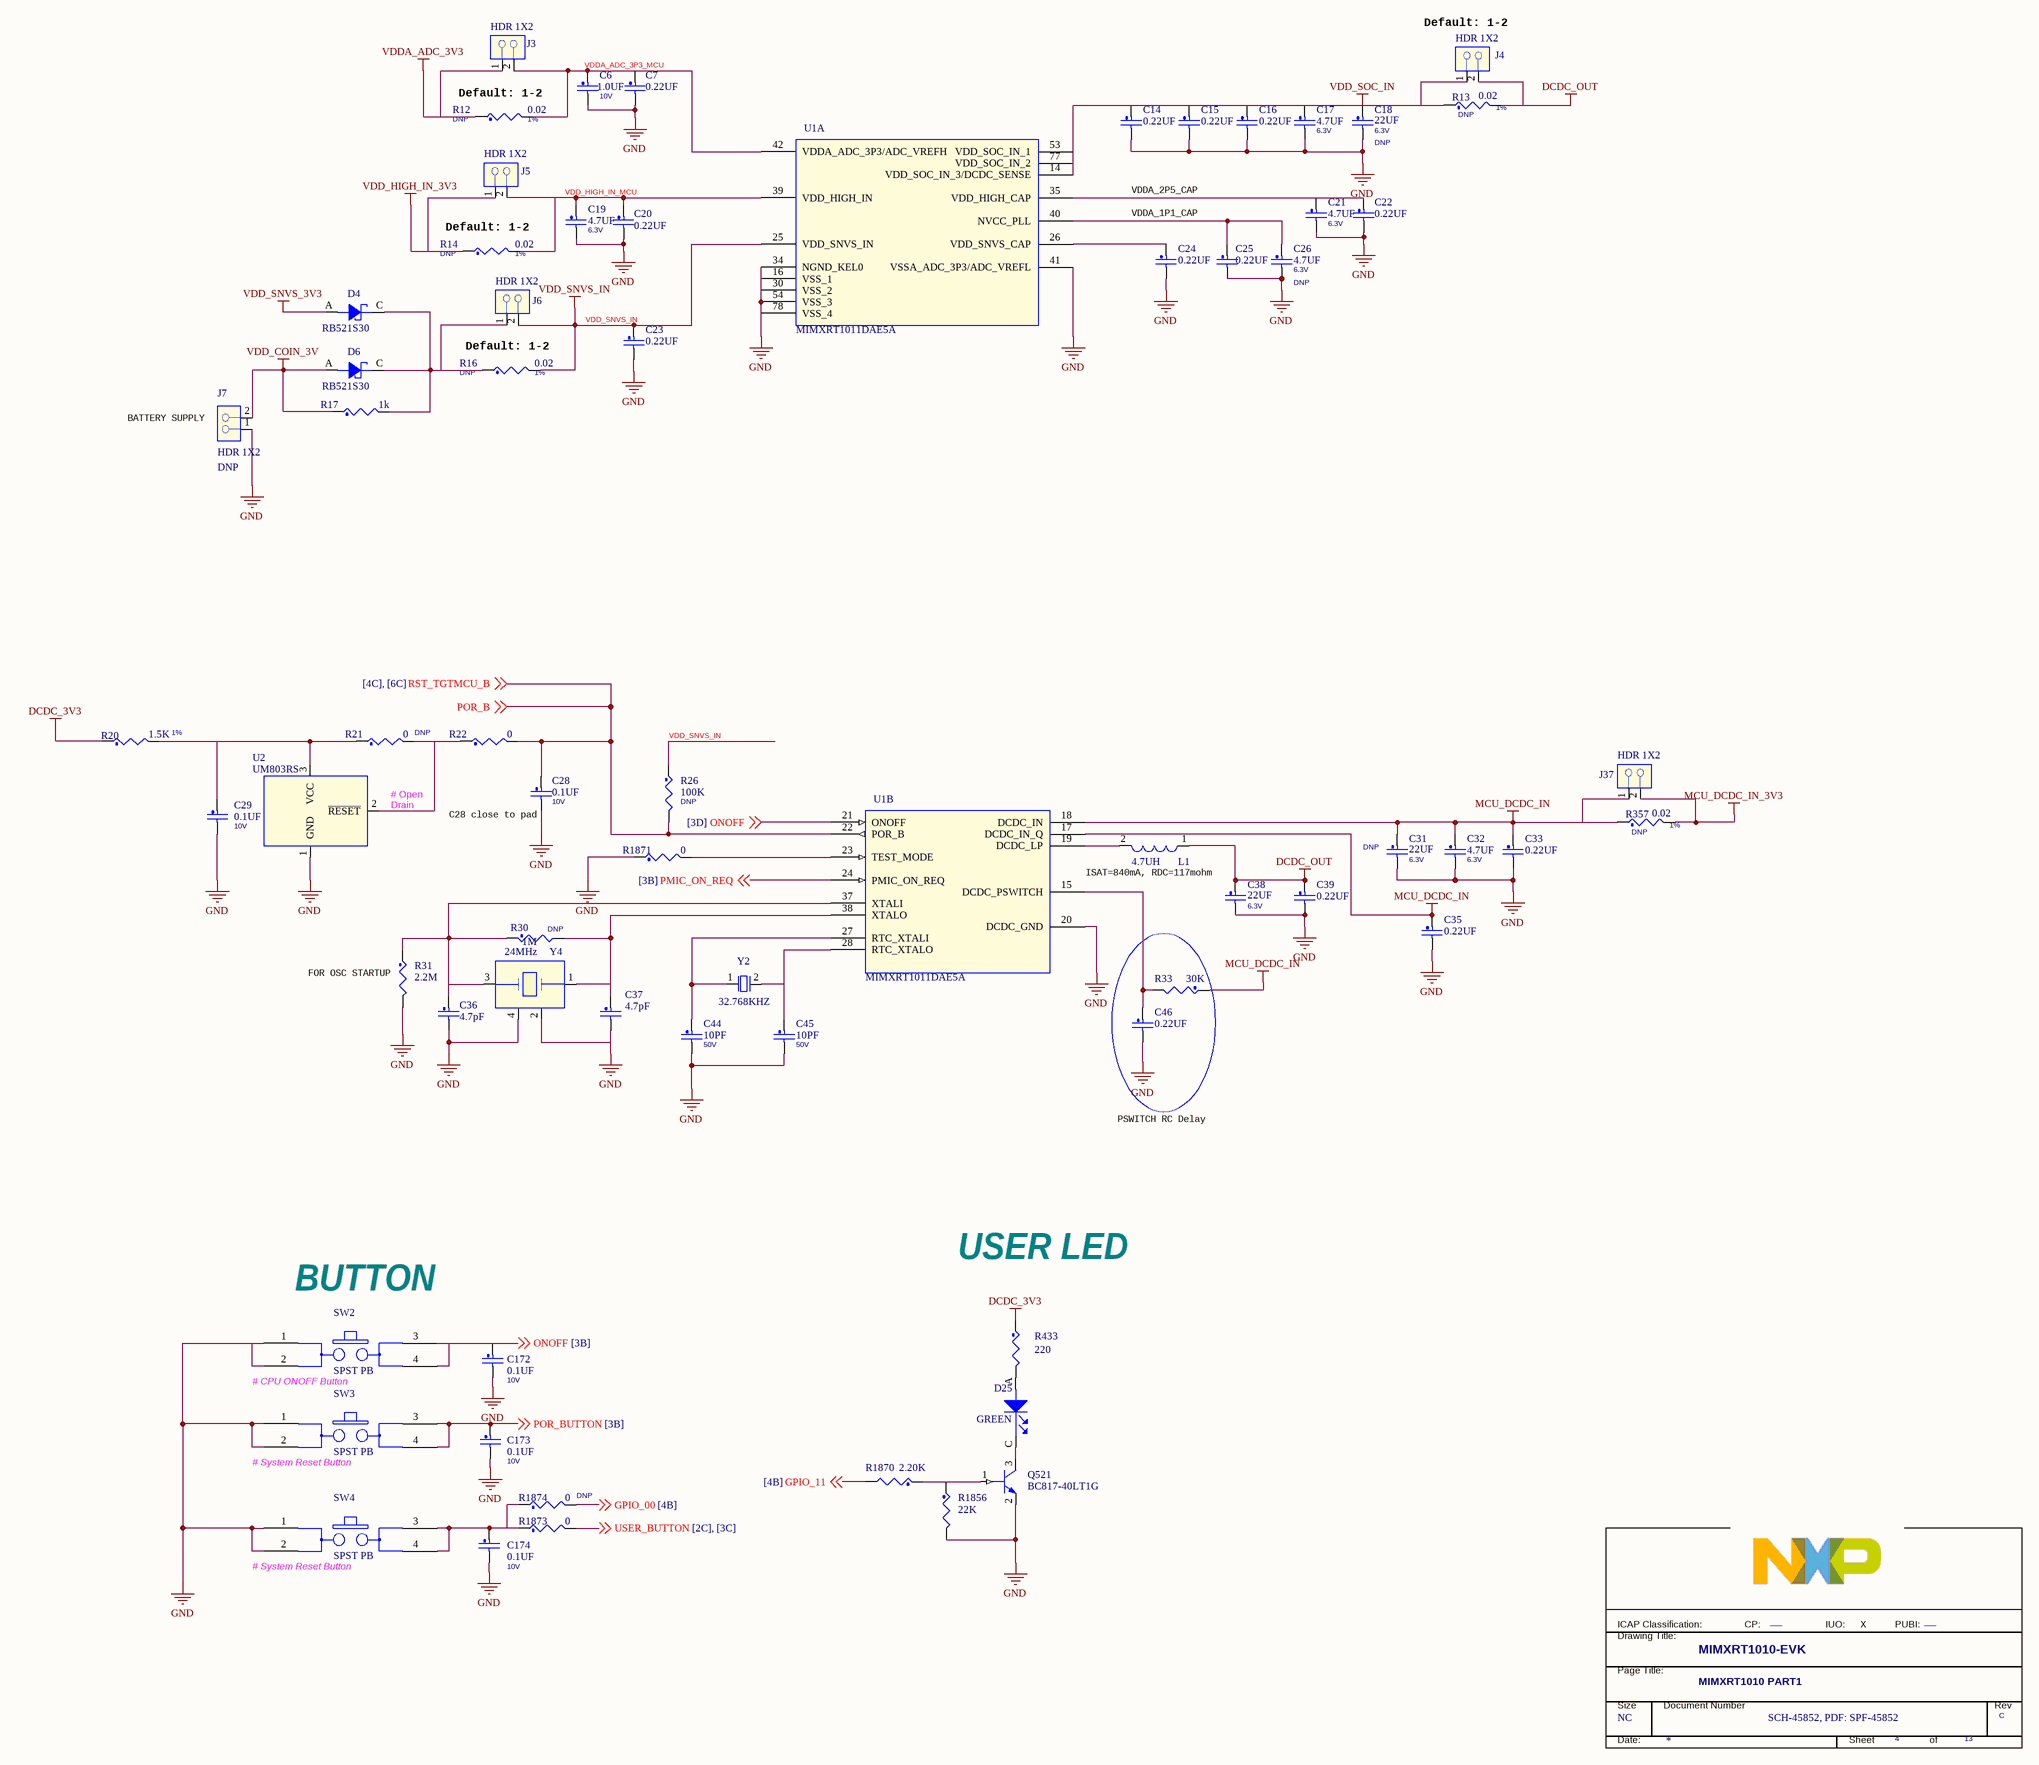
[diagram p4: 04 MIMXRT1010 PART1.SchDoc]

### Parts
(Parts that share a designator on the sheet are numbered #1, #2 ... from top to bottom, then left to right.)
*#4  PUBI: ___  Doc: SCH-45852, PDF: SPF-45852  RevCode: C  Title: MIMXRT1010-EVK  Page Size: NC  Page Number: 4  Page Count: 13  PageTitle: MIMXRT1010 PART1  (hidden comment: TitleBlock_FS)  (graphical)
C6  1.0UF  VOLTAGE: 10V  [0402_cc]
C7  0.22UF  [0402_CC]
C14  0.22UF  [0402_CC]
C15  0.22UF  [0402_CC]
C16  0.22UF  [0402_CC]
C17  4.7UF  VOLTAGE: 6.3V  [0402_CC]
C18  22UF  ASSY_OPT: DNP  voltage rating: 6.3V  [0603_CC]
C19  4.7UF  voltage rating: 6.3V  [0402_CC]
C20  0.22UF  [0402_CC]
C21  4.7UF  voltage rating: 6.3V  [0402_CC]
C22  0.22UF  [0402_CC]
C23  0.22UF  [0402_CC]
C24  0.22UF  [0402_CC]
C25  0.22UF  [0402_CC]
C26  4.7UF  ASSY_OPT: DNP  voltage rating: 6.3V  [0402_CC]
C28  0.1UF  VOLTAGE: 10V  [CC0402_25]
C29  0.1UF  VOLTAGE: 10V  [CC0402_25]
C31  22UF  ASSY_OPT: DNP  voltage rating: 6.3V  [0603_CC]
C32  4.7UF  voltage rating: 6.3V  [0402_CC]
C33  0.22UF  [0402_CC]
C35  0.22UF  [0402_CC]
C36  4.7pF  [0402_CC]
C37  4.7pF  [0402_CC]
C38  22UF  voltage rating: 6.3V  [0603_CC]
C39  0.22UF  [0402_CC]
C44  10PF  VOLTAGE: 50V  [0402_CC]
C45  10PF  VOLTAGE: 50V  [0402_CC]
C46  0.22UF  [0402_CC]
C172  0.1UF  VOLTAGE: 10V  [CC0402_25]
C173  0.1UF  VOLTAGE: 10V  [CC0402_25]
C174  0.1UF  VOLTAGE: 10V  [CC0402_25]
D4  RB521S30  [SOD523]
D6  RB521S30  [SOD523]
D25  GREEN  [LED_0603]
J3  HDR 1X2  [HDR102]
J4  HDR 1X2  [HDR102]
J5  HDR 1X2  [HDR102]
J6  HDR 1X2  [HDR102]
J7  HDR 1X2  ASSY_OPT: DNP  [HDR102]
J37  HDR 1X2  [HDR102]
L1  4.7UH  [ind_1515]
Q521  BC817-40LT1G  [SOT23]
R12  0.02  ASSY_OPT: DNP  TOL: 1%  [RC0603_OV]
R13  0.02  TOL: 1%  ASSY_OPT: DNP  [RC0603_OV]
R14  0.02  ASSY_OPT: DNP  TOL: 1%  [RC0603_OV]
R16  0.02  TOL: 1%  ASSY_OPT: DNP  [RC0603_OV]
R17  1k  [0402_CC]
R20  1.5K  Tolerance: 1%  [0402_CC]
R21  0  ASSY_OPT: DNP  [0402_CC]
R22  0  [0402_CC]
R26  100K  ASSY_OPT: DNP  [0402_CC]
R30  1M  ASSY_OPT: DNP  [0402_CC]
R31  2.2M  [RC0402_25]
R33  30K  [RC0402_25]
R357  0.02  ASSY_OPT: DNP  TOL: 1%  [RC0603_OV]
R433  220  [RC0603_OV]
R1856  22K  [RC0402_25]
R1870  2.20K  [RC0603_OV]
R1871  0  [0402_CC]
R1873  0  [0402_CC]
R1874  0  ASSY_OPT: DNP  [0402_CC]
SW2  SPST PB  [SW4_PB_ESW_SM_P177]
SW3  SPST PB  [SW4_PB_ESW_SM_P177]
SW4  SPST PB  [SW4_PB_ESW_SM_P177]
U1  MIMXRT1011DAE5A  [LQFP80_0P5_12X12]  (parts A,B of 5)
U2  UM803RS  [sot-23]
Y2  32.768KHZ  [XTAL2-3p2x1p5-SM]
Y4  24MHz  [xtl4_2p1x1p7mm_sm]

### Nets
DCDC_3V3: R20.1 R433.1
DCDC_OUT: C38.1 C39.1 J4.2 L1.1 R13.2
GND: C6.2 C7.2 C14.2 C15.2 C16.2 C17.2 C18.2 C19.2 C20.2 C21.2 C22.2 C23.2 C24.2 C25.2 C26.2 C28.2 C29.2 C31.2 C32.2 C33.2 C35.2 C36.2 C37.2 C38.2 C39.2 C44.2 C45.2 C46.2 C172.2 C173.2 C174.2 J7.1 Q521.2(EMITTER) R31.2 R1856.2 R1871.1 SW2.1(A1) SW2.2(A2) SW3.1(A1) SW3.2(A2) SW4.1(A1) SW4.2(A2) U1.16(VSS_1) U1.20(DCDC_GND) U1.30(VSS_2) U1.34(NGND_KEL0) U1.41(VSSA_ADC_3P3/ADC_VREFL) U1.54(VSS_3) U1.78(VSS_4) U2.1(GND) Y4.2 Y4.4
MCU_DCDC_IN: C31.1 C32.1 C33.1 C35.1 J37.1 R33.1 R357.1 U1.17(DCDC_IN_Q) U1.18(DCDC_IN)
MCU_DCDC_IN_3V3: J37.2 R357.2
VDD_COIN_3V: D6.A J7.2 R17.1
VDD_HIGH_IN_3V3: J5.1 R14.1
VDD_SNVS_3V3: D4.A
VDD_SNVS_IN: C23.1 J6.2 R16.2 R26.1 U1.25(VDD_SNVS_IN)
VDD_SOC_IN: C14.1 C15.1 C16.1 C17.1 C18.1 J4.1 R13.1 U1.14(VDD_SOC_IN_3/DCDC_SENSE) U1.53(VDD_SOC_IN_1) U1.77(VDD_SOC_IN_2)
VDDA_ADC_3V3: J3.1 R12.1
GPIO_00: R1874.2 ; off-sheet GPIO_00  [project net AUD_INT]
GPIO_11: R1870.2 ; off-sheet GPIO_11
ONOFF: C172.1 SW2.3(B1) SW2.4(B2) U1.21(ONOFF) ; off-sheet ONOFF
PMIC_ON_REQ: U1.24(PMIC_ON_REQ) ; off-sheet PMIC_ON_REQ
POR_B: C28.1 R22.2 R26.2 U1.22(POR_B) ; off-sheet RST_TGTMCU_B, off-sheet POR_B  [also labelled RST_TGTMCU_B]
POR_BUTTON: C173.1 SW3.3(B1) SW3.4(B2) ; off-sheet POR_BUTTON
USER_BUTTON: R1873.2 ; off-sheet USER_BUTTON
VDD_HIGH_IN_MCU: C19.1 C20.1 J5.2 R14.2 U1.39(VDD_HIGH_IN)
VDDA_ADC_3P3_MCU: C6.1 C7.1 J3.2 R12.2 U1.42(VDDA_ADC_3P3/ADC_VREFH)
NetC21_1: C21.1 C22.1 U1.35(VDD_HIGH_CAP)
NetC24_1: C24.1 U1.26(VDD_SNVS_CAP)
NetC25_1: C25.1 C26.1 U1.40(NVCC_PLL)
NetC29_1: C29.1 R20.2 R21.1 U2.3(VCC)
NetC36_1: C36.1 R30.1 R31.1 U1.37(XTALI) Y4.3
NetC37_1: C37.1 R30.2 U1.38(XTALO) Y4.1
NetC44_1: C44.1 U1.27(RTC_XTALI) Y2.1
NetC45_1: C45.1 U1.28(RTC_XTALO) Y2.2
NetC46_1: C46.1 R33.2 U1.15(DCDC_PSWITCH)
NetC174_1: C174.1 R1873.1 R1874.1 SW4.3(B1) SW4.4(B2)
NetD4_C: D4.C D6.C J6.1 R16.1 R17.2
NetD25_A: D25.A(ANODE) R433.2
NetD25_C: D25.C(CATHODE) Q521.3(COLLECTOR)
NetL1_2: L1.2 U1.19(DCDC_LP)
NetQ521_1: Q521.1(BASE) R1856.1 R1870.1
NetR21_2: R21.2 R22.1 U2.2(~{RESET})
NetR1871_2: R1871.2 U1.23(TEST_MODE)

### Notes on the sheet
- (near J4) Default: 1-2
- (near R12) Default: 1-2
- VDDA_2P5_CAP
- VDDA_1P1_CAP
- (near R14) Default: 1-2
- Default: 1-2
- BATTERY SUPPLY
- (near U2) # Open
  Drain
- (near C28) C28 close to pad
- ISAT=840mA, RDC=117mohm
- (near R31) FOR OSC STARTUP
- PSWITCH RC Delay
- (near SW2) BUTTON
- USER LED
- (near SW2) # CPU ONOFF Button
- (near SW3) # System Reset Button
- (near SW4) # System Reset Button
- X
- (in symbol TitleBlock_FS) ICAP Classification:; CP:; IUO:; PUBI:; Drawing Title:; Page Title:; Size; Document Number; Rev; Date:; Sheet; of

### Library data of the parts
*#4 = TitleBlock_FS: as *#2 on sheet 02 BLOCK DIAGRAM; FCP: ___; Page Create Date: March  8, 1995; Page Modify Date: *
C6 = CAP_NP: as C61 on sheet 03 MAIN POWER; PCB Footprint: 0402_cc; HEIGHT: 0.6MM; ROHS: Yes
C7 C20 C22 C24 C25 C35 C46 = CAP_NP: as C54 on sheet 03 MAIN POWER; PCB Footprint: 0402_CC; Tolerance: 20%; ROHS: Yes; HEIGHT: 0.55MM; VOLTAGE: 6.3V
C14-C16 C23 C33 C39 = CAP_NP: CAP CER 0.22UF 6.3V 20% X5R 0402; CLASS: DISCRETE; FPLIST: CC0402_25,CC0402_HD,0402_CC; CAD_APPROVED: Yes; MFG_PN01: C0402C224M9PAC; MFG_NAME01: KEMET; AGILE_PN: 150-76271; PCB Footprint: 0402_CC; VOLTAGE: 6.3V; HEIGHT: 0.55MM; ROHS: Yes; Tolerance: 20%
C17 C21 C26 = CAP_NP: CAP CER 4.7UF 6.3V 20% X5R 0402; CLASS: DISCRETE; AGILE_PN: 150-78463; MFG_NAME01: TDK; MFG_PN01: C1005X5R0J475M050BC; CAD_APPROVED: Yes; FPLIST: CC0402_25,CC0402_HD,0402_CC; PCB Footprint: 0402_CC; Tolerance: 20%; ROHS: Yes; HEIGHT: 0.65MM
  C17: voltage rating: 6.3V
  C21 C26: VOLTAGE: 6.3V
C18 = CAP_NP: as C52 on sheet 03 MAIN POWER; PCB Footprint: 0603_CC; Tolerance: 20%; ROHS: Yes; HEIGHT: 1MM; VOLTAGE: 6.3V
C19 C32 = CAP_NP: as C42 on sheet 03 MAIN POWER; PCB Footprint: 0402_CC; HEIGHT: 0.65MM; ROHS: Yes; Tolerance: 20%; VOLTAGE: 6.3V
C28 C29 C173 C174 = CAP_NP: as C51 on sheet 03 MAIN POWER; PCB Footprint: CC0402_25; Tolerance: 10%; ROHS: Yes; HEIGHT: 0.64MM
C31 C38 = CAP_NP: CAP CER 22UF 6.3V 20% X5R 0603; CLASS: DISCRETE; FPLIST: CC0603_OV,CC0603,0603_CC; CAD_APPROVED: Yes; MFG_PN01: CL10A226MQ8NRNE; MFG_NAME01: Samsung; AGILE_PN: 150-78467; PCB Footprint: 0603_CC; VOLTAGE: 6.3V; HEIGHT: 1MM; ROHS: Yes; Tolerance: 20%
C36 = CAP_NP: CAP CER 4.7PF 50V 0.25PF C0G 0402; CLASS: DISCRETE; FPLIST: CC0402_25,CC0402_HD,0402_CC; CAD_APPROVED: Yes; MFG_PN01: 04025A4R7CAT2A; MFG_NAME01: AVX; AGILE_PN: 150-76335; PCB Footprint: 0402_CC; VOLTAGE: 50V; HEIGHT: 0.56MM; ROHS: Yes; Tolerance: 0.25pF
C37 = CAP_NP: CAP CER 4.7PF 50V 0.25PF C0G 0402; CLASS: DISCRETE; AGILE_PN: 150-76335; MFG_NAME01: AVX; MFG_PN01: 04025A4R7CAT2A; CAD_APPROVED: Yes; FPLIST: CC0402_25,CC0402_HD,0402_CC; PCB Footprint: 0402_CC; Tolerance: 0.25pF; ROHS: Yes; HEIGHT: 0.56MM; VOLTAGE: 50V
C44 C45 = CAP_NP: CAP CER 10PF 50V 5% C0G 0402; CLASS: DISCRETE; AGILE_PN: 150-75265; MFG_NAME01: AVX; MFG_PN01: 04025A100JAT2A; CAD_APPROVED: YES; FPLIST: CC0402_25,CC0402_HD,0402_CC; PCB Footprint: 0402_CC; Tolerance: 5%; ROHS: Yes; HEIGHT: 0.635MM
C172 = CAP_NP: as C41 on sheet 03 MAIN POWER; PCB Footprint: CC0402_25; HEIGHT: 0.64MM; ROHS: Yes; Tolerance: 10%
D4 = DIODE_SCHTKY: as D9 on sheet 03 MAIN POWER; ROHS: Yes; HEIGHT: 0.65MM; PCB Footprint: SOD523
D6 = DIODE_SCHTKY: as D10 on sheet 03 MAIN POWER; HEIGHT: 0.65MM; ROHS: Yes; PCB Footprint: SOD523
D25 = LED: as D27 on sheet 03 MAIN POWER; PCB Footprint: LED_0603; ROHS: Yes; HEIGHT: 0.85MM
J3 J4 = CONN_HDR_2X1: as J8 on sheet 03 MAIN POWER; ROHS: Yes; HEIGHT: 8.59MM; PCB Footprint: HDR102
J5-J7 J37 = CONN_HDR_2X1: HDR 1X2 TH 100MIL SP 339H AU 98L; CLASS: IO; CAD_APPROVED: Yes; Temp_Range: -55¡ãC to +105¡ãC; MFG_PN01: 0901S0202011N9T-31RF; MFG_NAME01: ANYTRONIC CORPORATION LIMITED; AGILE_PN: 210-81490; HEIGHT: 8.59MM; ROHS: Yes; PCB Footprint: HDR102
L1 = INDUCTOR: IND FER BEAD 4.7uH@100KHZ 0.84A 20% 1515; PART_TYPE: INDUCTOR\1515; CLASS: DISCRETE; CAD_APPROVED: Yes; Temp_Range: -40C - 125C; MFG_PN01: LQH44PN4R7MJ0L; MFG_NAME01: MURATA; AGILE_PN: 180-78961; HEIGHT: 1.2MM; ROHS: Yes; Tolerance: 20%; PCB Footprint: ind_1515
Q521 = NPN: TRAN NPN GEN 45V 0.5A SOT-23; CLASS: IC; CAD_APPROVED: Yes; MFG_NAME01: ON SEMICONDUCTOR; AGILE_PN: 480-75158; PCB Footprint: SOT23; HEIGHT: 1.11 MM; ROHS: Yes; MFG_PN01: BC817-40LT1G
R12 R14 R357 = RES: RES MF 0.02 OHM 1/10W 1% 0603; CLASS: DISCRETE; FPLIST: RC0603_OV,RC0603,0603_CC; CAD_APPROVED: Yes; MFG_PN01: WSL0603R0200FEA; MFG_NAME01: VISHAY INTERTECHNOLOGY; AGILE_PN: 470-80199; Tolerance: 1%; HEIGHT: 0.457MM; ROHS: Yes; PCB Footprint: RC0603_OV
R13 R16 = RES: RES MF 0.02 OHM 1/10W 1% 0603; CLASS: DISCRETE; AGILE_PN: 470-80199; MFG_NAME01: VISHAY INTERTECHNOLOGY; MFG_PN01: WSL0603R0200FEA; CAD_APPROVED: Yes; FPLIST: RC0603_OV,RC0603,0603_CC; ROHS: Yes; HEIGHT: 0.457MM; Tolerance: 1%; PCB Footprint: RC0603_OV
R17 = RES_Dup1: as R803 on sheet 03 MAIN POWER; Tolerance: 5%; ROHS: Yes; HEIGHT: 0.41mm; PCB Footprint: 0402_CC
R20 = RES_Dup1: RES MF 1.5K 1/16W 1% 0402; CLASS: DISCRETE; FPLIST: RC0402_25,RC0402_HD,0402_CC; CAD_APPROVED: Yes; MFG_PN01: CR0402-FX-1501GLF; MFG_NAME01: BOURNS; AGILE_PN: 470-80487; HEIGHT: 0.4MM; ROHS: Yes; PCB Footprint: 0402_CC
R21 R22 R1874 = RES_Dup1: as R37 on sheet 03 MAIN POWER; HEIGHT: 0.45 MM; Tolerance: 5%; ROHS: Yes; PCB Footprint: 0402_CC
R26 = RES_Dup1: RES MF 100K 1/16W 5% 0402; CLASS: DISCRETE; Temp_Range: -55C to +155C; FPLIST: RC0402_25,RC0402_HD,0402_CC; CAD_APPROVED: Yes; MFG_PN01: CR0402-16W-104JT; MFG_NAME01: VENKEL COMPANY; AGILE_PN: 470-75597; ROHS: Yes; Tolerance: 5%; HEIGHT: 0.40 MM; PCB Footprint: 0402_CC
R30 = RES_Dup1: RES MF 1M 1/10W 5% AEC-Q200 0402; CLASS: DISCRETE; AGILE_PN: 470-79978; MFG_NAME01: KOA SPEER; MFG_PN01: RK73B1ETTP105J; CAD_APPROVED: Yes; FPLIST: RC0402_25,RC0402_HD,0402_CC; Temp_Range: -55&#8451; to 155&#8451;; PCB Footprint: 0402_CC; HEIGHT: 0.4MM; Tolerance: 5%; ROHS: Yes
R31 = RES_Dup1: RES MF 2.2M 1/10W 1% AEC-Q200 0402; CLASS: DISCRETE; AGILE_PN: 470-31210; MFG_NAME01: KOA SPEER; MFG_PN01: RK73H1ETTP2204F; Temp_Range: -55C to +155C; CAD_APPROVED: Yes; FPLIST: RC0402_25,RC0402_HD,0402_CC; Tolerance: 1%; ROHS: Yes; HEIGHT: 0.40 MM; PCB Footprint: RC0402_25
R33 = RES_Dup1: RES MF 30K 1/16W 1% 0402; CLASS: DISCRETE; AGILE_PN: 470-76590; MFG_NAME01: THYE MING TECH CO LTD; MFG_PN01: CR02FL6-30K; CAD_APPROVED: Yes; FPLIST: RC0402_25,RC0402_HD,0402_CC; Tolerance: 1%; ROHS: Yes; HEIGHT: 0.4MM; PCB Footprint: RC0402_25
R433 = RES_Dup1: RES MF 220 OHM 1/10W 5% 0603; CLASS: DISCRETE; FPLIST: RC0603_OV,RC0603,0603_CC; CAD_APPROVED: Yes; MFG_PN01: RC0603JR-07220RL; MFG_NAME01: YAGEO AMERICA; AGILE_PN: 470-30297; PCB Footprint: RC0603_OV; HEIGHT: 0.6MM; ROHS: Yes; Tolerance: 5%
R1856 = RES_Dup1: RES MF 22K 1/16W 5% 0402; CLASS: DISCRETE; AGILE_PN: 470-75609; MFG_NAME01: SMEC; MFG_PN01: RC73L2Z223JTF; CAD_APPROVED: Yes; FPLIST: RC0402_25,RC0402_HD,0402_CC; PCB Footprint: RC0402_25; Tolerance: 5%; ROHS: Yes; HEIGHT: 0.41mm
R1870 = RES_Dup1: RES MF 2.20K 1/10W 1% 0603; CLASS: DISCRETE; AGILE_PN: 470-75806; MFG_NAME01: BOURNS; MFG_PN01: CR0603-FX-2201ELF; CAD_APPROVED: Yes; FPLIST: RC0603_OV,RC0603,0603_CC; PCB Footprint: RC0603_OV; Tolerance: 1%; ROHS: Yes; HEIGHT: 0.55 MM
R1871 R1873 = RES_Dup1: as R35 on sheet 03 MAIN POWER; PCB Footprint: 0402_CC; ROHS: Yes; Tolerance: 5%; HEIGHT: 0.45 MM
SW2 SW4 = SW_PB_ESW: SW SPST MOM NO PB TACT 50mA 50V SMT; CLASS: IC; CAD_APPROVED: Yes; MFG_PN01: TL3301AF260QG/TR; MFG_NAME01: E SWITCH; AGILE_PN: 510-77562; PCB Footprint: SW4_PB_ESW_SM_P177; HEIGHT: 5MM; ROHS: Yes
SW3 = SW_PB_ESW: SW SPST MOM NO PB TACT 50mA 50V SMT; CLASS: IC; AGILE_PN: 510-77562; MFG_NAME01: E SWITCH; MFG_PN01: TL3301AF260QG/TR; CAD_APPROVED: Yes; ROHS: Yes; HEIGHT: 5MM; PCB Footprint: SW4_PB_ESW_SM_P177
U1 = RT1010_LQFP80: IC CPU ARM Cortex-M7 500MHZ 1.3V LQFP80; AGILE_PN: 344-02363; MFG_NAME01: NXP SEMICONDUCTORS; MFG_PN01: MIMXRT1011DAE5A; ROHS: Yes; HEIGHT: 1.6MM; PCB Footprint: LQFP80_0P5_12X12
U2 = SGM803_SOT23-3P: IC VOLT MONITOR 2.63V RST VTH 1-5.5V AUTO SOT-23; AGILE_PN: 315-80553; MFG_NAME01: Union Semiconductor, Inc; CAD_APPROVED: Yes; CLASS: IC; MFG_PN01: UM803RS; ROHS: Yes; HEIGHT: 1.25MM; PCB Footprint: sot-23
Y2 = CRYSTAL: XTAL 32.768KHZ 7PF 20PPM -- SMT; CLASS: IC; AGILE_PN: 230-78102; MFG_NAME01: EPSON ELECTRONICS; MFG_PN01: FC-135 32.7680KA-AG3; CAD_APPROVED: Yes; PCB Footprint: XTAL2-3p2x1p5-SM; ROHS: Yes; HEIGHT: 0.9MM
Y4 = XTAL_13: XTAL 24MHZ -- 20PPM 2.0X1.6MM SMD; CLASS: IC; CAD_APPROVED: Yes; Temp_Range: -30C to 85C; MFG_PN01: XRCGB24M000F2P29R0; MFG_NAME01: MURATA; AGILE_PN: 230-78216; PCB Footprint: xtl4_2p1x1p7mm_sm; HEIGHT: 0.7MM; ROHS: Yes

## Sheet 05 MIMXRT1010 PART2.SchDoc
size 513 x 386 mm
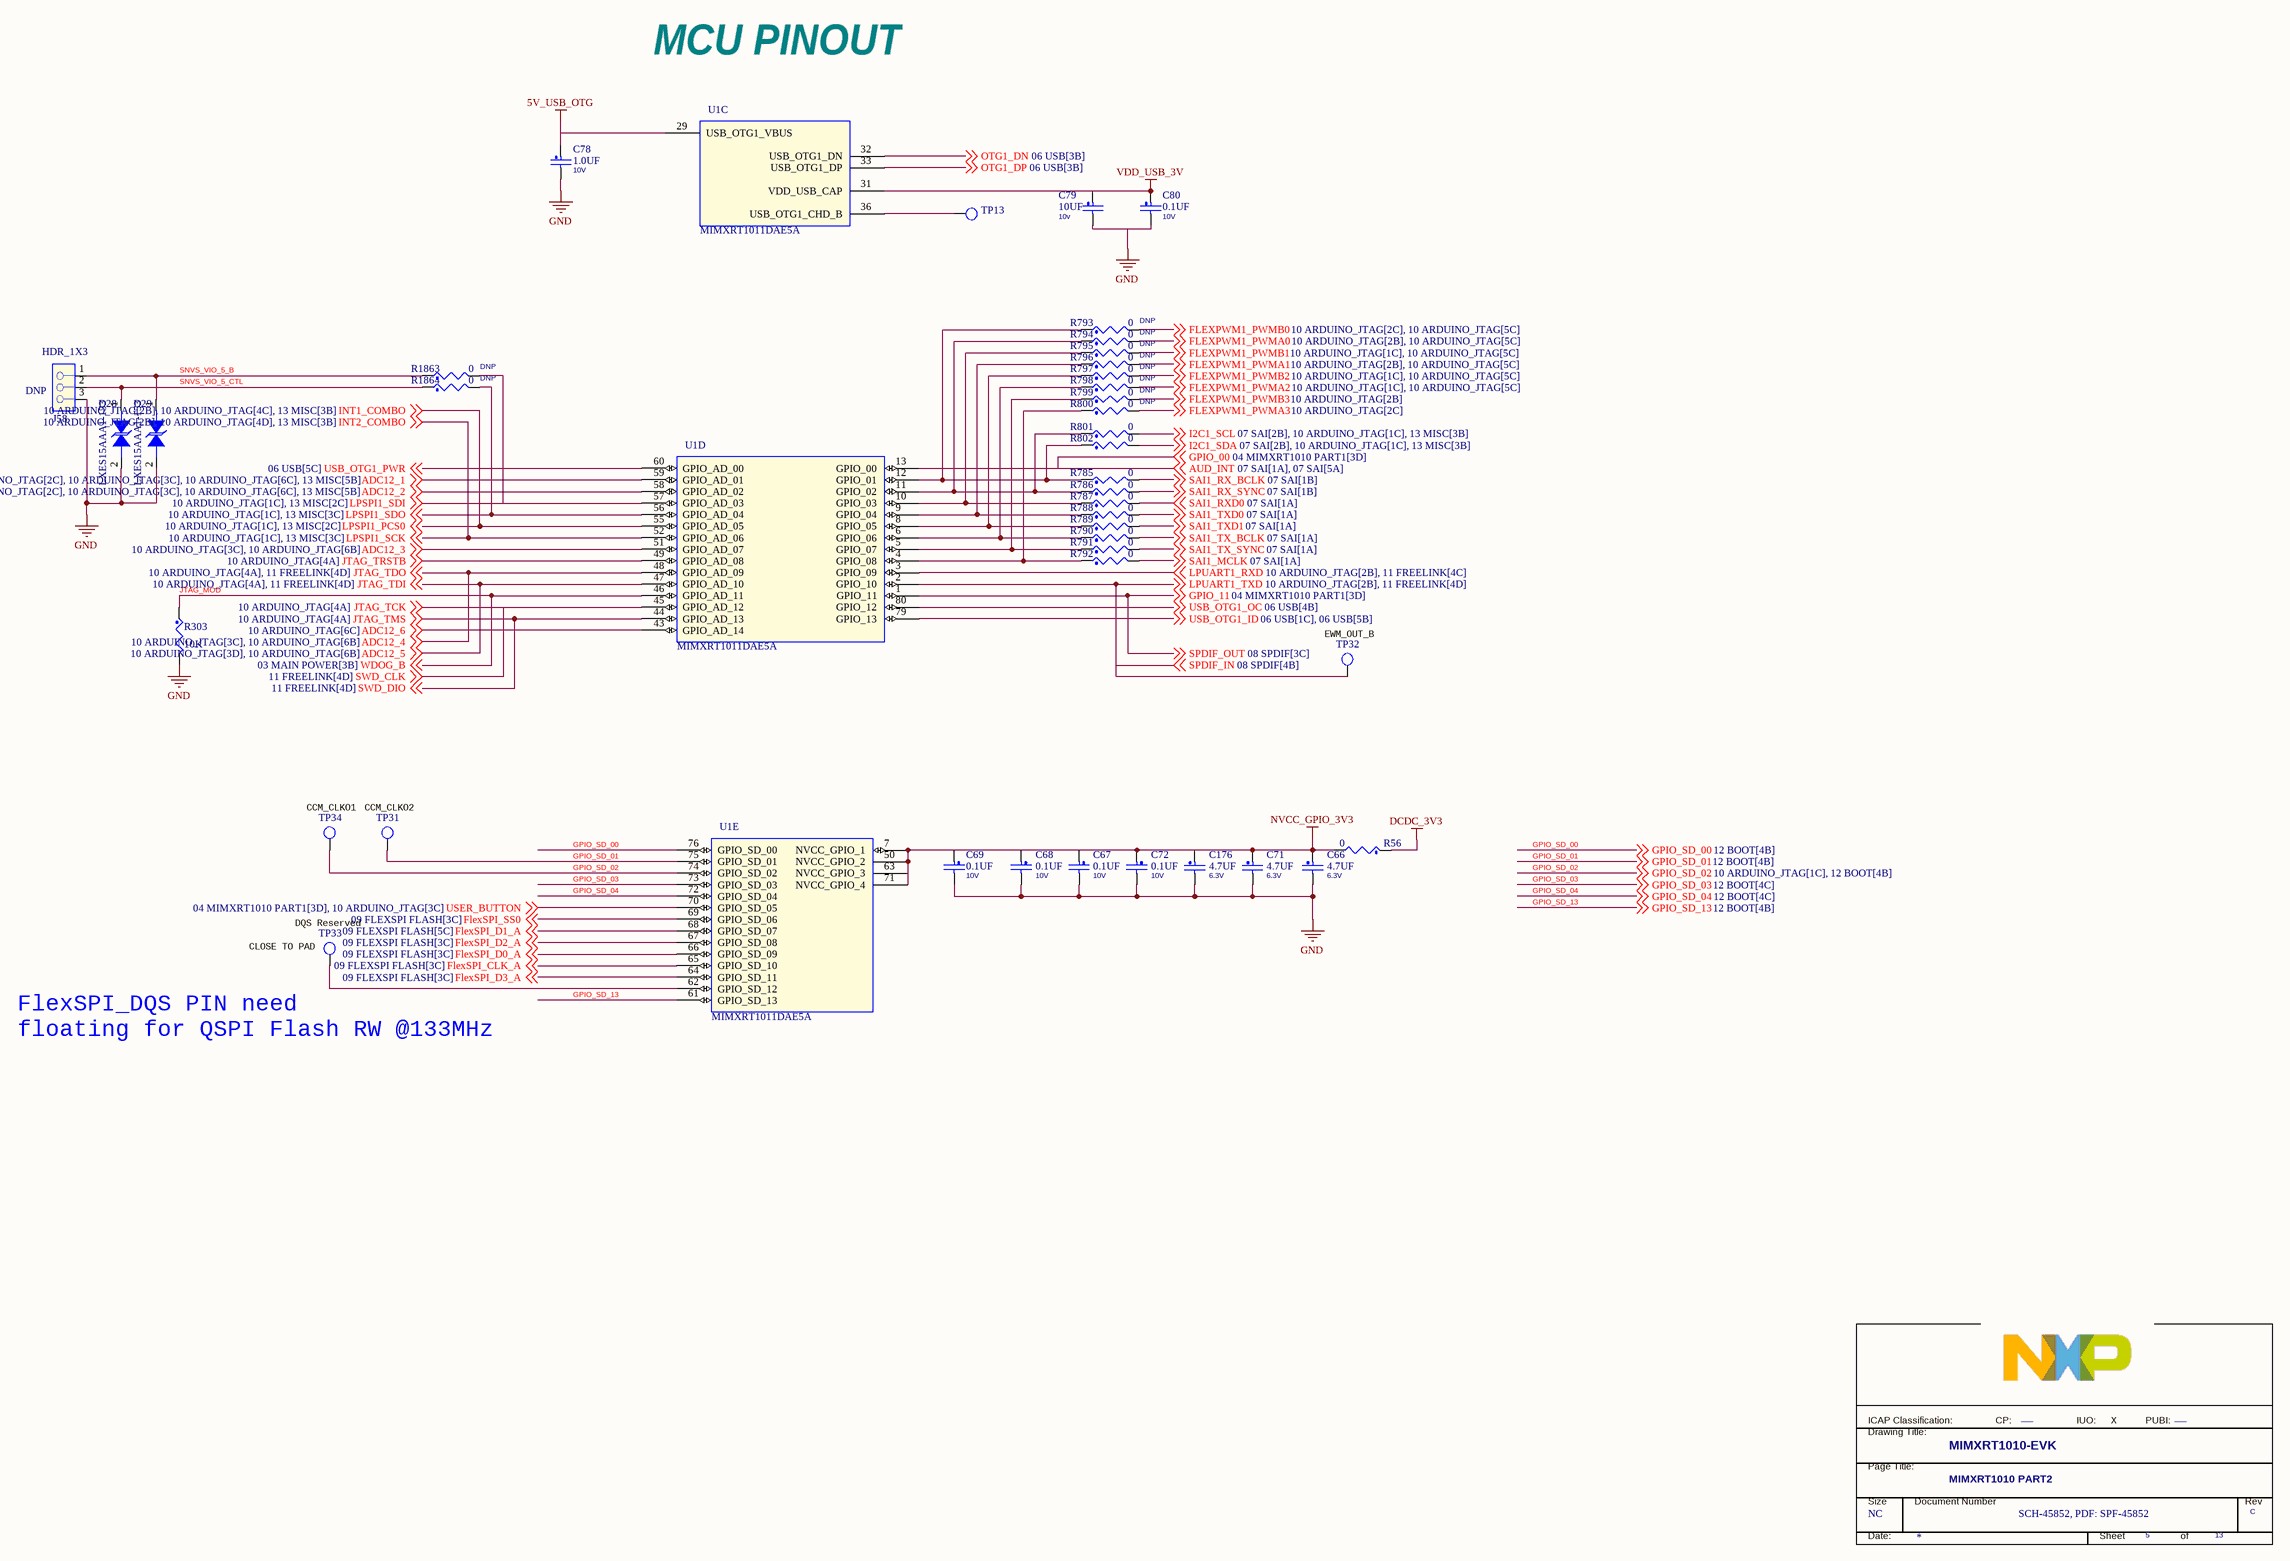
[diagram p5: 05 MIMXRT1010 PART2.SchDoc]

### Parts
(Parts that share a designator on the sheet are numbered #1, #2 ... from top to bottom, then left to right.)
*#5  PUBI: ___  Doc: SCH-45852, PDF: SPF-45852  RevCode: C  Title: MIMXRT1010-EVK  Page Size: NC  Page Number: 5  Page Count: 13  PageTitle: MIMXRT1010 PART2  (hidden comment: TitleBlock_FS)  (graphical)
C66  4.7UF  voltage rating: 6.3V  [0402_CC]
C67  0.1UF  VOLTAGE: 10V  [CC0402_25]
C68  0.1UF  VOLTAGE: 10V  [CC0402_25]
C69  0.1UF  VOLTAGE: 10V  [CC0402_25]
C71  4.7UF  voltage rating: 6.3V  [0402_CC]
C72  0.1UF  VOLTAGE: 10V  [CC0402_25]
C78  1.0UF  VOLTAGE: 10V  [0402_cc]
C79  10UF  VOLTAGE: 10v  [CC0603_OV]
C80  0.1UF  VOLTAGE: 10V  [CC0402_25]
C176  4.7UF  VOLTAGE: 6.3V  [0402_CC]
D28  LXES15AAA1-153  [diode_bidir_0402]
D29  LXES15AAA1-153  [diode_bidir_0402]
J58  HDR_1X3  ASSY_OPT: DNP  [HDR103]
R56  0  [0402_CC]
R303  10K  [0402_CC]
R785  0  [0402_CC]
R786  0  [0402_CC]
R787  0  [0402_CC]
R788  0  [0402_CC]
R789  0  [0402_CC]
R790  0  [0402_CC]
R791  0  [0402_CC]
R792  0  [0402_CC]
R793  0  ASSY_OPT: DNP  [0402_CC]
R794  0  ASSY_OPT: DNP  [0402_CC]
R795  0  ASSY_OPT: DNP  [0402_CC]
R796  0  ASSY_OPT: DNP  [0402_CC]
R797  0  ASSY_OPT: DNP  [0402_CC]
R798  0  ASSY_OPT: DNP  [0402_CC]
R799  0  ASSY_OPT: DNP  [0402_CC]
R800  0  ASSY_OPT: DNP  [0402_CC]
R801  0  [0402_CC]
R802  0  [0402_CC]
R1863  0  ASSY_OPT: DNP  [0402_CC]
R1864  0  ASSY_OPT: DNP  [0402_CC]
TP13  TP_35MIL  [testpoint_35mil]  (value not drawn)
TP31  TP_35MIL  [testpoint_35mil]  (value not drawn)
TP32  TP_35MIL  [testpoint_35mil]  (value not drawn)
TP33  TP_35MIL  [testpoint_35mil]  (value not drawn)
TP34  TP_35MIL  [testpoint_35mil]  (value not drawn)
U1  MIMXRT1011DAE5A  [LQFP80_0P5_12X12]  (parts C,D,E of 5)

### Nets
5V_USB_OTG: C78.1 U1.29(USB_OTG1_VBUS)
DCDC_3V3: R56.1
GND: C66.2 C67.2 C68.2 C69.2 C71.2 C72.2 C78.2 C79.2 C80.2 C176.2 D28.2(A2) D29.2(A2) J58.3 R303.2
NVCC_GPIO_3V3: C66.1 C67.1 C68.1 C69.1 C71.1 C72.1 C176.1 R56.2 U1.7(NVCC_GPIO_1) U1.50(NVCC_GPIO_2) U1.63(NVCC_GPIO_3) U1.71(NVCC_GPIO_4)
VDD_USB_3V: C79.1 C80.1 U1.31(VDD_USB_CAP)
ADC12_1: U1.59(GPIO_AD_01) ; off-sheet ADC12_1
ADC12_2: U1.58(GPIO_AD_02) ; off-sheet ADC12_2
ADC12_3: U1.51(GPIO_AD_07) ; off-sheet ADC12_3
ADC12_6: U1.43(GPIO_AD_14) ; off-sheet ADC12_6
AUD_INT: U1.13(GPIO_00) ; off-sheet AUD_INT, off-sheet GPIO_00  [also labelled GPIO_00]
FLEXPWM1_PWMA0: R794.2 ; off-sheet FLEXPWM1_PWMA0
FLEXPWM1_PWMA1: R796.2 ; off-sheet FLEXPWM1_PWMA1
FLEXPWM1_PWMA2: R798.2 ; off-sheet FLEXPWM1_PWMA2
FLEXPWM1_PWMA3: R800.2 ; off-sheet FLEXPWM1_PWMA3
FLEXPWM1_PWMB0: R793.2 ; off-sheet FLEXPWM1_PWMB0
FLEXPWM1_PWMB1: R795.2 ; off-sheet FLEXPWM1_PWMB1
FLEXPWM1_PWMB2: R797.2 ; off-sheet FLEXPWM1_PWMB2
FLEXPWM1_PWMB3: R799.2 ; off-sheet FLEXPWM1_PWMB3
FlexSPI_CLK_A: U1.65(GPIO_SD_10) ; off-sheet FlexSPI_CLK_A
FlexSPI_D0_A: U1.66(GPIO_SD_09) ; off-sheet FlexSPI_D0_A
FlexSPI_D1_A: U1.68(GPIO_SD_07) ; off-sheet FlexSPI_D1_A
FlexSPI_D2_A: U1.67(GPIO_SD_08) ; off-sheet FlexSPI_D2_A
FlexSPI_D3_A: U1.64(GPIO_SD_11) ; off-sheet FlexSPI_D3_A
FlexSPI_SS0: U1.69(GPIO_SD_06) ; off-sheet FlexSPI_SS0
GPIO_11: U1.1(GPIO_11) ; off-sheet SPDIF_OUT, off-sheet GPIO_11  [also labelled SPDIF_OUT]
GPIO_SD_00: U1.76(GPIO_SD_00) ; off-sheet GPIO_SD_00  [project net BT_CFG[2]]
GPIO_SD_01: TP31.1(TP) U1.75(GPIO_SD_01) ; off-sheet GPIO_SD_01  [project net BT_CFG[1]]
GPIO_SD_02: TP34.1(TP) U1.74(GPIO_SD_02) ; off-sheet GPIO_SD_02  [project net BT_CFG[0]]
GPIO_SD_03: U1.73(GPIO_SD_03) ; off-sheet GPIO_SD_03  [project net BOOT_MODE[1]]
GPIO_SD_04: U1.72(GPIO_SD_04) ; off-sheet GPIO_SD_04  [project net BOOT_MODE[0]]
GPIO_SD_13: U1.61(GPIO_SD_13) ; off-sheet GPIO_SD_13  [project net BT_CFG[3]]
I2C1_SCL: R801.2 ; off-sheet I2C1_SCL
I2C1_SDA: R802.2 ; off-sheet I2C1_SDA
INT1_COMBO: U1.55(GPIO_AD_05) ; off-sheet LPSPI1_PCS0, off-sheet INT1_COMBO  [also labelled LPSPI1_PCS0]
INT2_COMBO: U1.52(GPIO_AD_06) ; off-sheet LPSPI1_SCK, off-sheet INT2_COMBO  [also labelled LPSPI1_SCK]
JTAG_MOD: R303.1 U1.46(GPIO_AD_11) ; off-sheet WDOG_B  [also labelled WDOG_B]
JTAG_TCK: U1.45(GPIO_AD_12) ; off-sheet SWD_CLK, off-sheet JTAG_TCK  [also labelled SWD_CLK]
JTAG_TDI: U1.47(GPIO_AD_10) ; off-sheet JTAG_TDI, off-sheet ADC12_5  [also labelled ADC12_5]
JTAG_TDO: U1.48(GPIO_AD_09) ; off-sheet JTAG_TDO, off-sheet ADC12_4  [also labelled ADC12_4]
JTAG_TMS: U1.44(GPIO_AD_13) ; off-sheet SWD_DIO, off-sheet JTAG_TMS  [also labelled SWD_DIO]
JTAG_TRSTB: U1.49(GPIO_AD_08) ; off-sheet JTAG_TRSTB
LPSPI1_SDI: R1863.2 U1.57(GPIO_AD_03) ; off-sheet LPSPI1_SDI
LPSPI1_SDO: R1864.2 U1.56(GPIO_AD_04) ; off-sheet LPSPI1_SDO
LPUART1_RXD: U1.3(GPIO_09) ; off-sheet LPUART1_RXD
LPUART1_TXD: TP32.1(TP) U1.2(GPIO_10) ; off-sheet LPUART1_TXD, off-sheet SPDIF_IN  [also labelled SPDIF_IN]
OTG1_DN: U1.32(USB_OTG1_DN) ; off-sheet OTG1_DN
OTG1_DP: U1.33(USB_OTG1_DP) ; off-sheet OTG1_DP
SAI1_MCLK: R792.2 ; off-sheet SAI1_MCLK
SAI1_RX_BCLK: R785.2 ; off-sheet SAI1_RX_BCLK
SAI1_RX_SYNC: R786.2 ; off-sheet SAI1_RX_SYNC
SAI1_RXD0: R787.2 ; off-sheet SAI1_RXD0
SAI1_TX_BCLK: R790.2 ; off-sheet SAI1_TX_BCLK
SAI1_TX_SYNC: R791.2 ; off-sheet SAI1_TX_SYNC
SAI1_TXD0: R788.2 ; off-sheet SAI1_TXD0
SAI1_TXD1: R789.2 ; off-sheet SAI1_TXD1
SNVS_VIO_5_B: D29.1(A1) J58.1 R1863.1
SNVS_VIO_5_CTL: D28.1(A1) J58.2 R1864.1
USB_OTG1_ID: U1.79(GPIO_13) ; off-sheet USB_OTG1_ID
USB_OTG1_OC: U1.80(GPIO_12) ; off-sheet USB_OTG1_OC
USB_OTG1_PWR: U1.60(GPIO_AD_00) ; off-sheet USB_OTG1_PWR
USER_BUTTON: U1.70(GPIO_SD_05) ; off-sheet USER_BUTTON
NetR785_1: R785.1 R793.1 R802.1 U1.12(GPIO_01)
NetR786_1: R786.1 R794.1 R801.1 U1.11(GPIO_02)
NetR787_1: R787.1 R795.1 U1.10(GPIO_03)
NetR788_1: R788.1 R796.1 U1.9(GPIO_04)
NetR789_1: R789.1 R797.1 U1.8(GPIO_05)
NetR790_1: R790.1 R798.1 U1.6(GPIO_06)
NetR791_1: R791.1 R799.1 U1.5(GPIO_07)
NetR792_1: R792.1 R800.1 U1.4(GPIO_08)
NetTP13_1: TP13.1(TP) U1.36(USB_OTG1_CHD_B)
NetTP33_1: TP33.1(TP) U1.62(GPIO_SD_12)

### Notes on the sheet
- MCU PINOUT
- (near TP32) EWM_OUT_B
- (near TP34) CCM_CLKO1
- (near TP31) CCM_CLKO2
- (near TP33) DQS Reserved
- (near TP33) CLOSE TO PAD
- (near TP33) FlexSPI_DQS PIN need
  floating for QSPI Flash RW @133MHz
- X
- (in symbol TitleBlock_FS) ICAP Classification:; CP:; IUO:; PUBI:; Drawing Title:; Page Title:; Size; Document Number; Rev; Date:; Sheet; of

### Library data of the parts
*#5 = TitleBlock_FS: FIUO: _X_; OrgName: Freescale Semiconductor; OrgAddr1: 6501 William Cannon Drive West; OrgAddr2: Austin, TX 78735-8598; FCP: ___; Page Create Date: March  8, 1995; Page Modify Date: *
C66 = CAP_NP: as C42 on sheet 03 MAIN POWER; PCB Footprint: 0402_CC; HEIGHT: 0.65MM; ROHS: Yes; Tolerance: 20%; VOLTAGE: 6.3V
C67 C72 = CAP_NP: as C41 on sheet 03 MAIN POWER; PCB Footprint: CC0402_25; HEIGHT: 0.64MM; ROHS: Yes; Tolerance: 10%
C68 C69 C80 = CAP_NP: as C51 on sheet 03 MAIN POWER; PCB Footprint: CC0402_25; Tolerance: 10%; ROHS: Yes; HEIGHT: 0.64MM
C71 C176 = CAP_NP: as C17 on sheet 04 MIMXRT1010 PART1; PCB Footprint: 0402_CC; Tolerance: 20%; ROHS: Yes; HEIGHT: 0.65MM
  C71: VOLTAGE: 6.3V
  C176: voltage rating: 6.3V
C78 = CAP_NP: CAP CER 1.0UF 10V 10% X5R 0402; CLASS: DISCRETE; AGILE_PN: 150-75772; MFG_NAME01: YAGEO AMERICA; MFG_PN01: CC0402KRX5R6BB105; CAD_APPROVED: Yes; FPLIST: CC0402_25,CC0402_HD,0402_CC; PCB Footprint: 0402_cc; ROHS: Yes; HEIGHT: 0.6MM
C79 = CAP_NP: as C50 on sheet 03 MAIN POWER; PCB Footprint: CC0603_OV; Tolerance: 10%; ROHS: Yes; HEIGHT: 1.016MM
D28 = DIODE_TVS_BIDIR: DIODE TVS BIDIR 4V -- 0402; CLASS: IC; AGILE_PN: 480-80015; MFG_NAME01: MURATA; Temp_Range: -40 to +85C; CAD_APPROVED: Yes; MFG_PN01: LXES15AAA1-153; ROHS: Yes; HEIGHT: 0.33MM; PCB Footprint: diode_bidir_0402
D29 = DIODE_TVS_BIDIR: DIODE TVS BIDIR 4V -- 0402; CLASS: IC; CAD_APPROVED: Yes; Temp_Range: -40 to +85C; MFG_NAME01: MURATA; AGILE_PN: 480-80015; HEIGHT: 0.33MM; ROHS: Yes; MFG_PN01: LXES15AAA1-153; PCB Footprint: diode_bidir_0402
J58 = CONN_HDR_3X1: HDR 1X3 TH 100MIL SP 338H AU 98L; CLASS: IO; AGILE_PN: 210-81491; MFG_NAME01: ANYTRONIC CORPORATION LIMITED; MFG_PN01: 0901S0203011N9T-31RF; Temp_Range: -55¡ãC to +105¡ãC; CAD_APPROVED: Yes; ROHS: Yes; HEIGHT: 8.59MM; PCB Footprint: HDR103
R56 R1864 = RES_Dup1: as R35 on sheet 03 MAIN POWER; PCB Footprint: 0402_CC; ROHS: Yes; Tolerance: 5%; HEIGHT: 0.45 MM
R303 = RES_Dup1: as R41 on sheet 03 MAIN POWER; HEIGHT: 0.4 MM; TOL: 5%; Tolerance: 5%; ROHS: Yes; PCB Footprint: 0402_CC
R785-R802 R1863 = RES_Dup1: as R37 on sheet 03 MAIN POWER; PCB Footprint: 0402_CC; HEIGHT: 0.45 MM; Tolerance: 5%; ROHS: Yes
TP13 TP31 = T POINT R: as TP8 on sheet 03 MAIN POWER; ROHS: Yes; HEIGHT: 0.1MM; PCB Footprint: testpoint_35mil
TP32-TP34 = T POINT R: TEST POINT PAD .035 SMT, no part to order; CLASS: IC; CAD_APPROVED: Yes; AGILE_PN: 510-75618; PCB Footprint: testpoint_35mil; HEIGHT: 0.1MM; ROHS: Yes
U1 = RT1010_LQFP80: IC CPU ARM Cortex-M7 500MHZ 1.3V LQFP80; MFG_NAME01: NXP SEMICONDUCTORS; AGILE_PN: 344-02363; HEIGHT: 1.6MM; ROHS: Yes; MFG_PN01: MIMXRT1011DAE5A; PCB Footprint: LQFP80_0P5_12X12

## Sheet 06 USB.SchDoc
size 513 x 386 mm
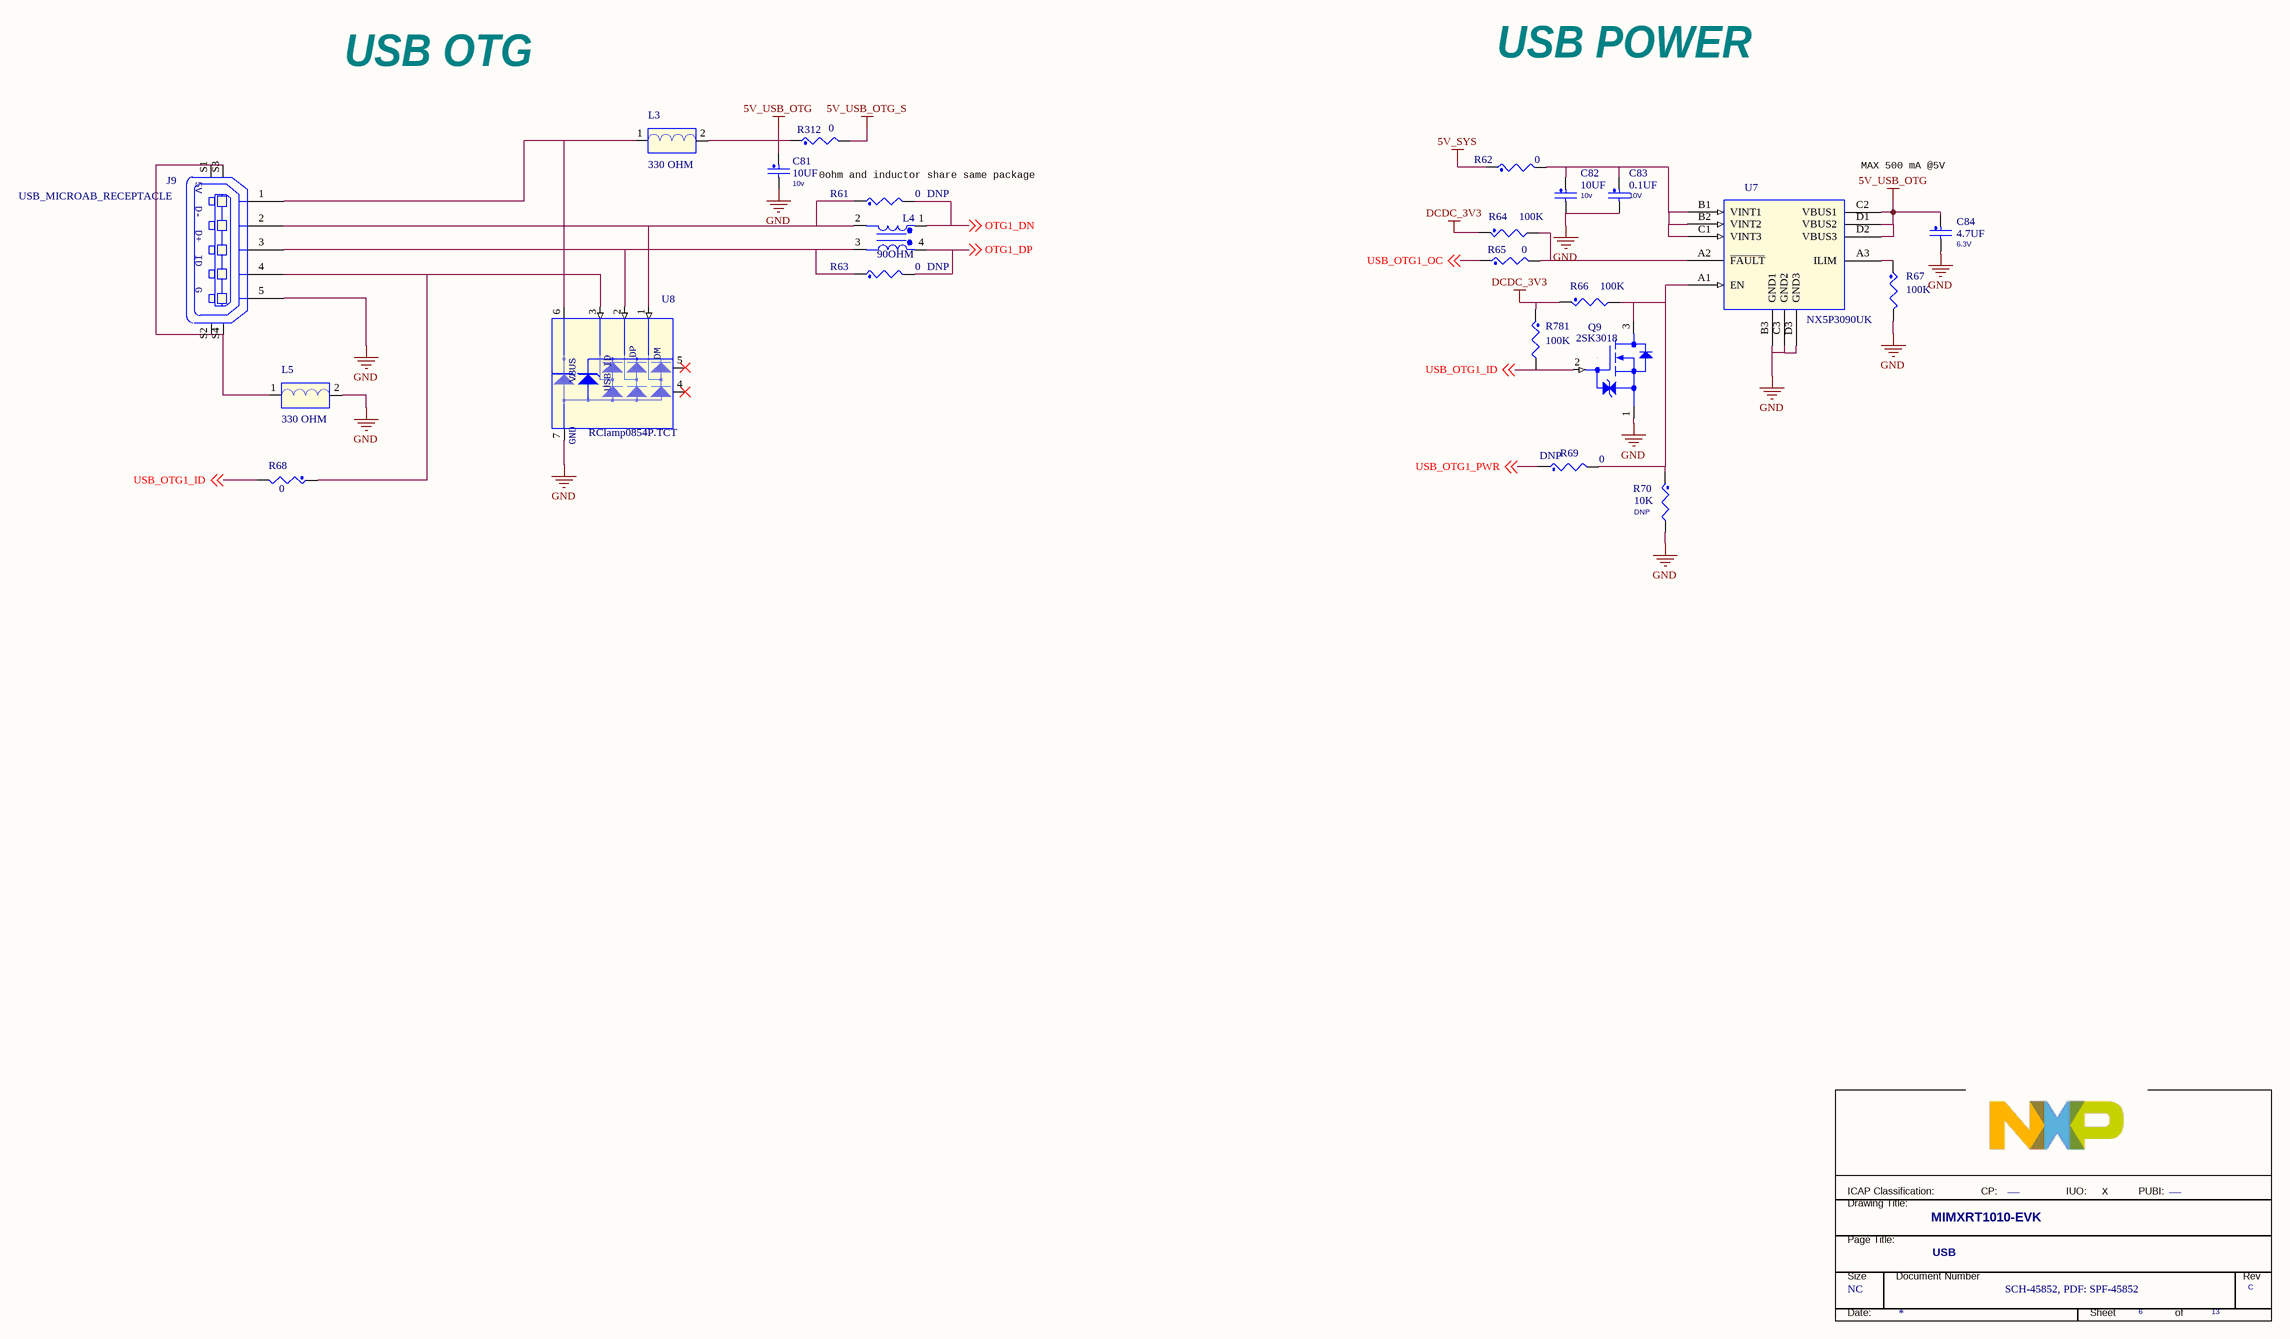
[diagram p6: 06 USB.SchDoc]

### Parts
(Parts that share a designator on the sheet are numbered #1, #2 ... from top to bottom, then left to right.)
*#6  PUBI: ___  Doc: SCH-45852, PDF: SPF-45852  RevCode: C  Title: MIMXRT1010-EVK  Page Size: NC  Page Number: 6  Page Count: 13  PageTitle: USB  (hidden comment: TitleBlock_FS)  (graphical)
C81  10UF  VOLTAGE: 10v  [CC0603_OV]
C82  10UF  VOLTAGE: 10v  [CC0603_OV]
C83  0.1UF  VOLTAGE: 10V  [CC0402_25]
C84  4.7UF  VOLTAGE: 6.3V  [0402_CC]
J9  USB_MICROAB_RECEPTACLE  [con_usb5_microab_0p65_sm]
L3  330 OHM  [ind_1608]
L4  90OHM  [ind4_choke_0805]
L5  330 OHM  [ind_1608]
Q9  2SK3018  [SOT323_3]
R61  0  ASSY_OPT: DNP  [0402_CC]
R62  0  [0402_CC]
R63  0  ASSY_OPT: DNP  [0402_CC]
R64  100K  [0402_CC]
R65  0  [0402_CC]
R66  100K  [0402_CC]
R67  100K  [RC0402_25]
R68  0  [0402_CC]
R69  0  ASSY_OPT: DNP  [0402_CC]
R70  10K  ASSY_OPT: DNP  [0402_CC]
R312  0  [0402_CC]
R781  100K  [0402_CC]
U7  NX5P3090UK  [wlcsp12_0p4_1p38x1p68mm_smdp]
U8  RClamp0854P.TCT  [slp1616p6]

### Nets
5V_SYS: R62.1
5V_USB_OTG: C81.1 C84.1 L3.2 R312.1 U7.C2(VBUS1) U7.D1(VBUS2) U7.D2(VBUS3)
5V_USB_OTG_S: R312.2
DCDC_3V3: R64.1 R66.1 R781.1
GND: C81.2 C82.2 C83.2 C84.2 J9.5(P5) L5.2 Q9.1(SOURCE) R67.2 R70.2 U7.B3(GND1) U7.C3(GND2) U7.D3(GND3) U8.7(GND)
OTG1_DN: L4.1 R61.2 ; off-sheet OTG1_DN
OTG1_DP: L4.4 R63.2 ; off-sheet OTG1_DP
USB_OTG1_ID: Q9.2(GATE) R68.2 R781.2 ; off-sheet USB_OTG1_ID
USB_OTG1_OC: R65.1 ; off-sheet USB_OTG1_OC
USB_OTG1_PWR: R69.1 ; off-sheet USB_OTG1_PWR
NetC82_1: C82.1 C83.1 R62.2 U7.B1(VINT1) U7.B2(VINT2) U7.C1(VINT3)
NetJ9_1: J9.1(P1) L3.1 U8.6(VBUS)
NetJ9_2: J9.2(P2) L4.2 R61.1 U8.1(DM)
NetJ9_3: J9.3(P3) L4.3 R63.1 U8.2(DP)
NetJ9_4: J9.4(P4) R68.1 U8.3(USB_ID)
NetJ9_S1: J9.S1(SHLD1) J9.S2(SHLD2) J9.S3(SHLD3) J9.S4(SHLD4) L5.1
NetQ9_3: Q9.3(DRAIN) R66.2 R69.2 R70.1 U7.A1(EN)
NetR64_2: R64.2 R65.2 U7.A2(~{FAULT})
NetR67_1: R67.1 U7.A3(ILIM)

Not connected (* = marked no-connect by the designer): U8 4(NC1)* 5(NC2)*

### Notes on the sheet
- USB OTG
- USB POWER
- 0ohm and inductor share same package
- MAX 500 mA @5V
- X
- (in symbol TitleBlock_FS) ICAP Classification:; CP:; IUO:; PUBI:; Drawing Title:; Page Title:; Size; Document Number; Rev; Date:; Sheet; of
- (in symbol USB_MINI_AB_RECEPTACLE) 5V; D-; D+; ID; G

### Library data of the parts
*#6 = TitleBlock_FS: as *#5 on sheet 05 MIMXRT1010 PART2; FCP: ___; Page Create Date: March  8, 1995; Page Modify Date: *
C81 = CAP_NP: as C50 on sheet 03 MAIN POWER; PCB Footprint: CC0603_OV; Tolerance: 10%; ROHS: Yes; HEIGHT: 1.016MM
C82 = CAP_NP: as C40 on sheet 03 MAIN POWER; PCB Footprint: CC0603_OV; HEIGHT: 1.016MM; ROHS: Yes; Tolerance: 10%
C83 = CAP_NP: as C51 on sheet 03 MAIN POWER; PCB Footprint: CC0402_25; Tolerance: 10%; ROHS: Yes; HEIGHT: 0.64MM
C84 = CAP_NP: as C42 on sheet 03 MAIN POWER; PCB Footprint: 0402_CC; HEIGHT: 0.65MM; ROHS: Yes; Tolerance: 20%; TOL: 20%
J9 = USB_MINI_AB_RECEPTACLE: CON 5 USB MICRO_AB RA SKT SMT 0.65MM SP 110H AU; CLASS: IO; CAD_APPROVED: Yes; Temp_Range: -55&#8451; to 105&#8451;; MFG_PN01: 23971101#LCP-58RF; MFG_NAME01: ANYTRONIC CORPORATION LIMITED; AGILE_PN: 211-80104; PCB Footprint: con_usb5_microab_0p65_sm; HEIGHT: 2.8MM; ROHS: Yes
L3 = BEAD: IND FER BEAD 330OHM@100MHZ 1.7A 0603; PART_TYPE: FERRITE\BEAD; CLASS: DISCRETE; TOL: 25%; CAD_APPROVED: Yes; MFG_PN01: MPZ1608S331A; MFG_NAME01: TDK; AGILE_PN: 180-78156; PCB Footprint: ind_1608; HEIGHT: 0.95MM; ROHS: Yes; Tolerance: 25%
L4 = DLW43: IND CHK 90 OHM@100MHZ 330MA 25% 0805; PART_TYPE: CHOKE; CLASS: DISCRETE; AGILE_PN: 180-76336; MFG_NAME01: MURATA; MFG_PN01: DLW21HN900SQ2L; CAD_APPROVED: Yes; Temp_Range: -40¡ãC to +85¡ãC; PCB Footprint: ind4_choke_0805; Tolerance: 25%; ROHS: Yes; HEIGHT: 1MM
L5 = BEAD: IND FER BEAD 330OHM@100MHZ 1.7A 0603; PART_TYPE: FERRITE\BEAD; CLASS: DISCRETE; AGILE_PN: 180-78156; Tolerance: 25%; MFG_NAME01: TDK; MFG_PN01: MPZ1608S331A; CAD_APPROVED: Yes; PCB Footprint: ind_1608; ROHS: Yes; HEIGHT: 0.95MM; TOL: 25%
Q9 = 2SK3018: TRANS MOSFET N-CH 30V .1A SOT-323; CLASS: IC; AGILE_PN: 480-75317; MFG_NAME01: ROHM; MFG_PN01: 2SK3018T106; CAD_APPROVED: Yes; PCB Footprint: SOT323_3; ROHS: Yes; HEIGHT: 0.9MM
R61 R63 R68 R69 R312 = RES_Dup1: as R35 on sheet 03 MAIN POWER; PCB Footprint: 0402_CC; ROHS: Yes; Tolerance: 5%; HEIGHT: 0.45 MM
R62 R65 = RES_Dup1: as R37 on sheet 03 MAIN POWER; HEIGHT: 0.45 MM; Tolerance: 5%; ROHS: Yes; PCB Footprint: 0402_CC
R64 = RES_Dup1: as R39 on sheet 03 MAIN POWER; Tolerance: 5%; HEIGHT: 0.40 MM; ROHS: Yes; TOL: 5%; PCB Footprint: 0402_CC
R66 = RES_Dup1: RES MF 100K 1/16W 5% 0402; CLASS: DISCRETE; AGILE_PN: 470-75597; MFG_NAME01: VENKEL COMPANY; MFG_PN01: CR0402-16W-104JT; CAD_APPROVED: Yes; FPLIST: RC0402_25,RC0402_HD,0402_CC; Temp_Range: -55C to +155C; TOL: 5%; ROHS: Yes; HEIGHT: 0.40 MM; Tolerance: 5%; PCB Footprint: 0402_CC
R67 = RES_Dup1: RES MF 100K 1/16W 1% 0402; CLASS: DISCRETE; FPLIST: RC0402_25,RC0402_HD,0402_CC; CAD_APPROVED: Yes; MFG_PN01: NRCL04F1003TRF; MFG_NAME01: NIC COMPONENTS CORP; AGILE_PN: 470-76240; HEIGHT: 0.4MM; ROHS: Yes; Tolerance: 1%; PCB Footprint: RC0402_25
R70 = RES_Dup1: as R41 on sheet 03 MAIN POWER; PCB Footprint: 0402_CC; Tolerance: 5%; ROHS: Yes; HEIGHT: 0.4 MM
R781 = RES_Dup1: as R26 on sheet 04 MIMXRT1010 PART1; PCB Footprint: 0402_CC; Tolerance: 5%; HEIGHT: 0.40 MM; ROHS: Yes; TOL: 5%
U7 = NX5P3090UK_WLCSP12: IC USB PD TYPE C CURRENT LIMITED PWR SW 2.5-5.5V WLCSP12; AGILE_PN: 312-81574; MFG_NAME01: NXP SEMICONDUCTORS; MFG_PN01: NX5P3090UK,012; CAD_APPROVED: Yes; CLASS: IC; ROHS: Yes; HEIGHT: 0.565 MM; PCB Footprint: wlcsp12_0p4_1p38x1p68mm_smdp
U8 = RCLAMP1654P_NEW: DIODE TVS ARRAY 3 5.5V SLP1616P6; CLASS: IC; CAD_APPROVED: Yes; MFG_NAME01: SEMTECH CORP; AGILE_PN: 480-78843; PCB Footprint: slp1616p6; HEIGHT: 0.65MM; ROHS: Yes; MFG_PN01: RClamp0854P.TCT